# EAGLE schematic RBCX (EAGLE 9.6.2), part 1 of 3
Assembly variants: TOP_SMD_FULL, TOP_SMD_WITHOUT_MPU, TOP_SMD_WITHOUT_MOTOR_CURRENT, TOP_SMD_WITHOUT_SERVO_CURRENT, TOP_SMD_WITHOUT_CURRENT, TOP_SMD_MINIMAL

## Sheet 1 of 8: Power
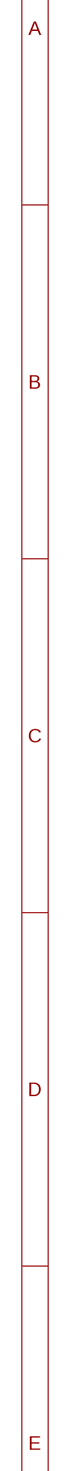
[diagram p0: schematic, sheet 1, part 1 of 2]
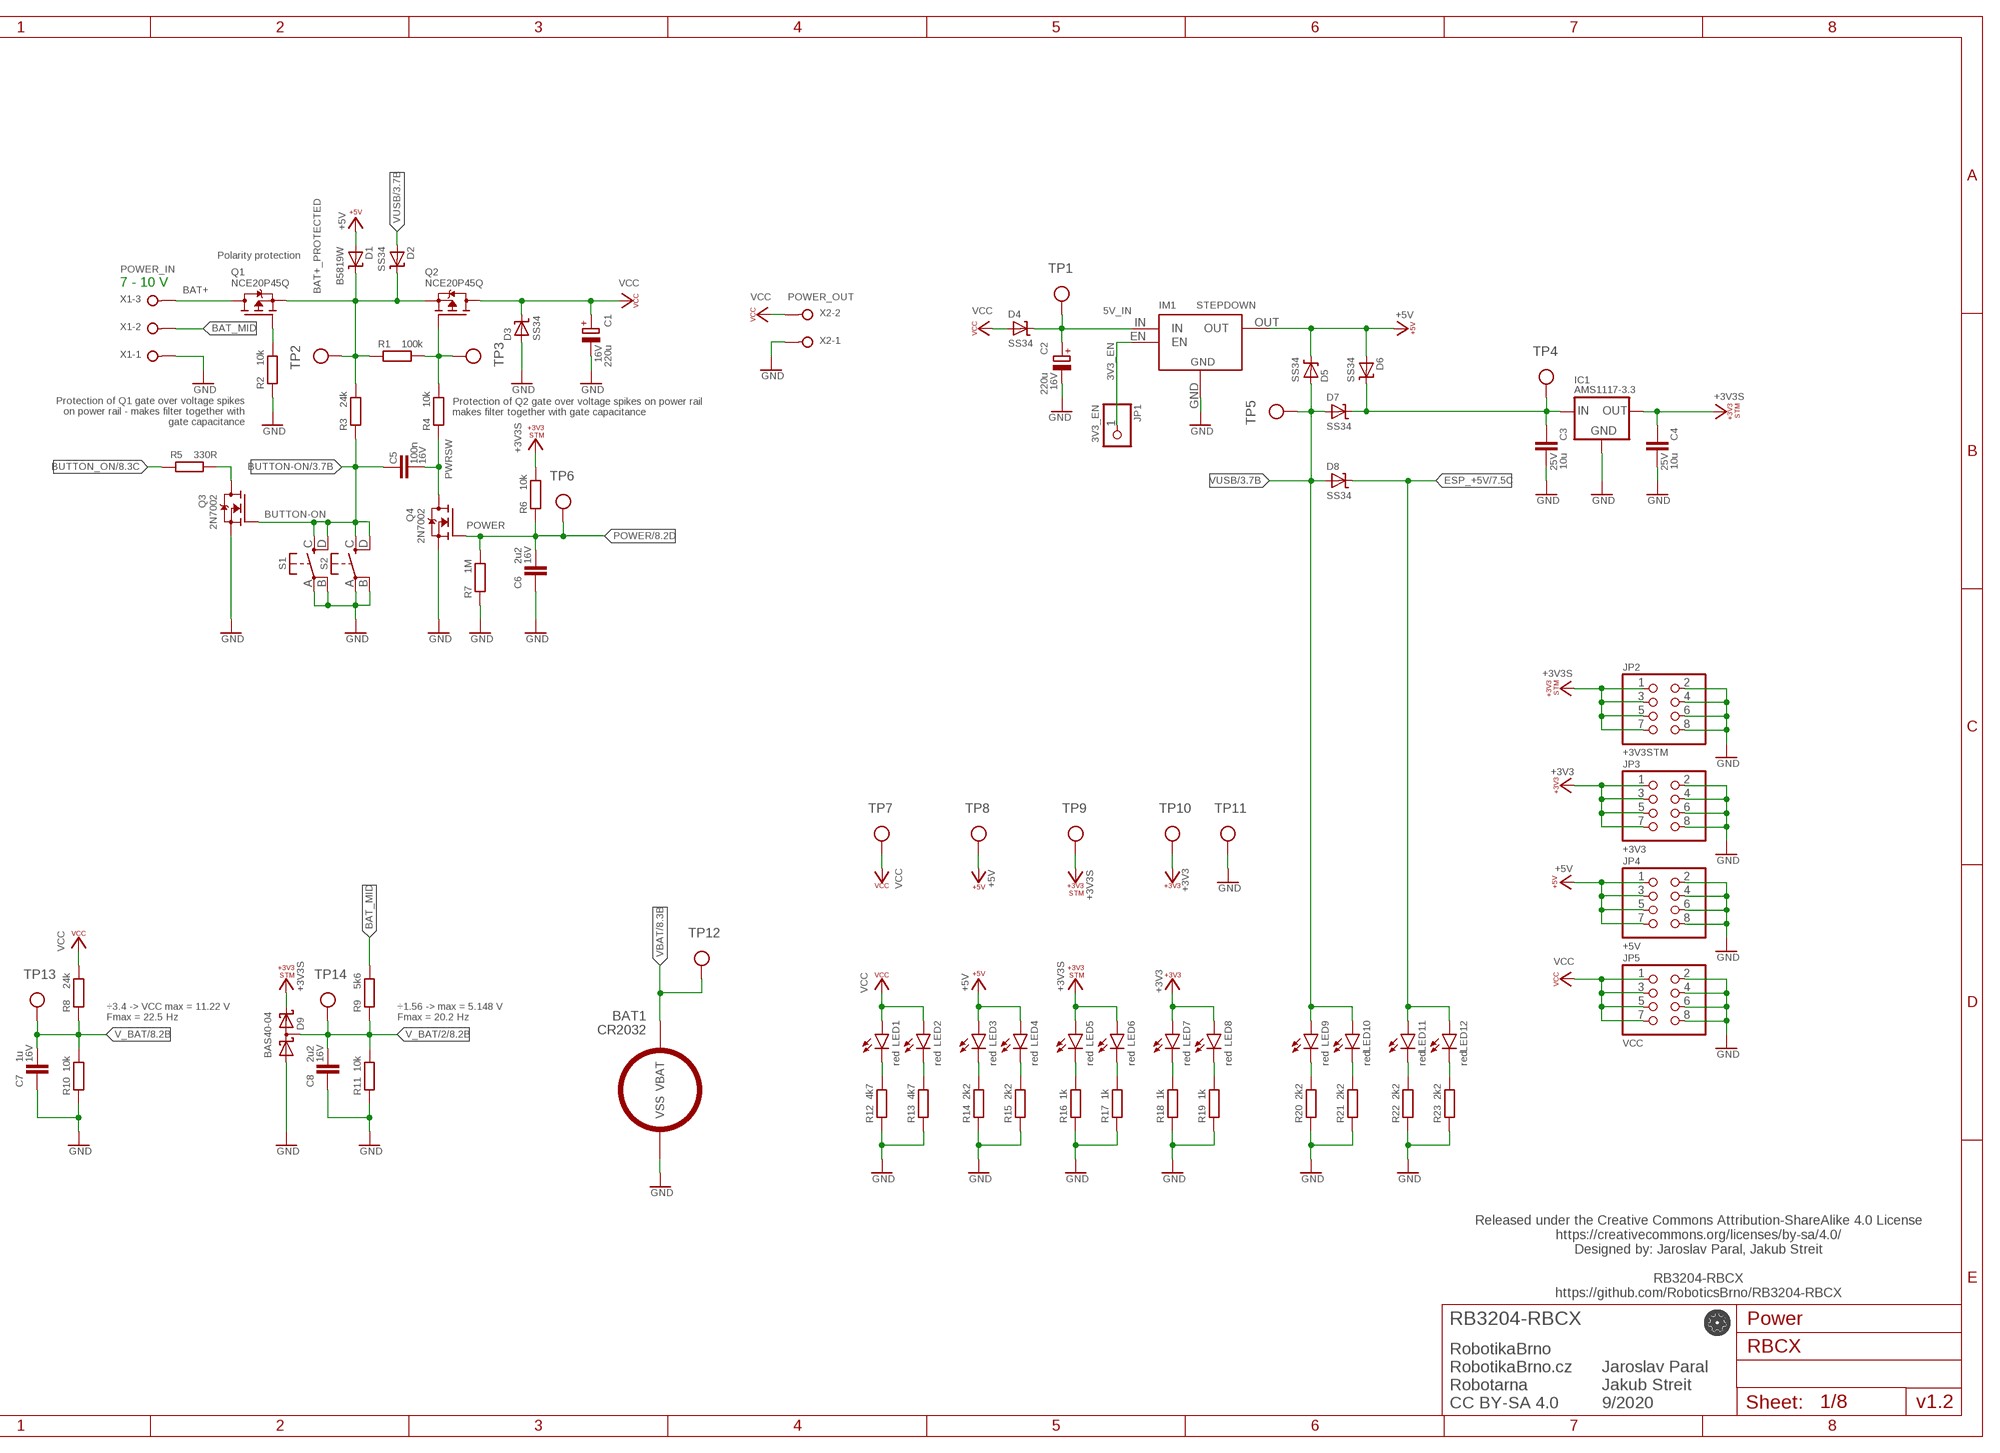
[diagram p1: schematic, sheet 1, part 2 of 2]

### Parts
BAT1  CR2032  CR2032CR2032-BS-6-1  [SMD-BAT-CR2032-BS-6-1]  (not fitted in variant TOP_SMD_FULL)  (not fitted in variant TOP_SMD_WITHOUT_MPU)  (not fitted in variant TOP_SMD_WITHOUT_MOTOR_CURRENT)  (not fitted in variant TOP_SMD_WITHOUT_SERVO_CURRENT)  (not fitted in variant TOP_SMD_WITHOUT_CURRENT)  (not fitted in variant TOP_SMD_MINIMAL)
C1  220u  CPOL-EUE5-10.5  [E5-10,5]  (not fitted in variant TOP_SMD_FULL)  (not fitted in variant TOP_SMD_WITHOUT_MPU)  (not fitted in variant TOP_SMD_WITHOUT_MOTOR_CURRENT)  (not fitted in variant TOP_SMD_WITHOUT_SERVO_CURRENT)  (not fitted in variant TOP_SMD_WITHOUT_CURRENT)  (not fitted in variant TOP_SMD_MINIMAL)
C2  220u  CPOL-EUE5-10.5  [E5-10,5]  (not fitted in variant TOP_SMD_FULL)  (not fitted in variant TOP_SMD_WITHOUT_MPU)  (not fitted in variant TOP_SMD_WITHOUT_MOTOR_CURRENT)  (not fitted in variant TOP_SMD_WITHOUT_SERVO_CURRENT)  (not fitted in variant TOP_SMD_WITHOUT_CURRENT)  (not fitted in variant TOP_SMD_MINIMAL)
C3  10u  C-EUC0805  [C0805]
C4  10u  C-EUC0805  [C0805]
C5  100n  C-EUC0402  [C0402]
C6  2u2  C-EUC0603  [C0603]
C7  1u  C-EUC0402  [C0402]
C8  2u2  C-EUC0603  [C0603]
D1  B5819W  SHOTTKY-SOD123  [SOD123]
D2  SS34  SHOTTKY-SMA  [SMA]
D3  SS34  SHOTTKY-SMA  [SMA]
D4  SS34  SHOTTKY-SMA  [SMA]
D5  SS34  SHOTTKY-SMA  [SMA]
D6  SS34  SHOTTKY-SMA  [SMA]
D7  SS34  SHOTTKY-SMA  [SMA]
D8  SS34  SHOTTKY-SMA  [SMA]
D9  BAS40-04  [SOT23]
IC1  AMS1117-3.3  AMS1117  [SOT223]
IM1  STEPDOWN  [STEPDOWN]  (not fitted in variant TOP_SMD_FULL)  (not fitted in variant TOP_SMD_WITHOUT_MPU)  (not fitted in variant TOP_SMD_WITHOUT_MOTOR_CURRENT)  (not fitted in variant TOP_SMD_WITHOUT_SERVO_CURRENT)  (not fitted in variant TOP_SMD_WITHOUT_CURRENT)  (not fitted in variant TOP_SMD_MINIMAL)
JP1  3V3_EN  PINHD-1X1  [1X01]  (not fitted in variant TOP_SMD_FULL)  (not fitted in variant TOP_SMD_WITHOUT_MPU)  (not fitted in variant TOP_SMD_WITHOUT_MOTOR_CURRENT)  (not fitted in variant TOP_SMD_WITHOUT_SERVO_CURRENT)  (not fitted in variant TOP_SMD_WITHOUT_CURRENT)  (not fitted in variant TOP_SMD_MINIMAL)
JP2  +3V3STM  PINHD-2X4  [2X04]  (not fitted in variant TOP_SMD_FULL)  (not fitted in variant TOP_SMD_WITHOUT_MPU)  (not fitted in variant TOP_SMD_WITHOUT_MOTOR_CURRENT)  (not fitted in variant TOP_SMD_WITHOUT_SERVO_CURRENT)  (not fitted in variant TOP_SMD_WITHOUT_CURRENT)  (not fitted in variant TOP_SMD_MINIMAL)
JP3  +3V3  PINHD-2X4  [2X04]  (not fitted in variant TOP_SMD_FULL)  (not fitted in variant TOP_SMD_WITHOUT_MPU)  (not fitted in variant TOP_SMD_WITHOUT_MOTOR_CURRENT)  (not fitted in variant TOP_SMD_WITHOUT_SERVO_CURRENT)  (not fitted in variant TOP_SMD_WITHOUT_CURRENT)  (not fitted in variant TOP_SMD_MINIMAL)
JP4  +5V  PINHD-2X4  [2X04]  (not fitted in variant TOP_SMD_FULL)  (not fitted in variant TOP_SMD_WITHOUT_MPU)  (not fitted in variant TOP_SMD_WITHOUT_MOTOR_CURRENT)  (not fitted in variant TOP_SMD_WITHOUT_SERVO_CURRENT)  (not fitted in variant TOP_SMD_WITHOUT_CURRENT)  (not fitted in variant TOP_SMD_MINIMAL)
JP5  VCC  PINHD-2X4  [2X04]  (not fitted in variant TOP_SMD_FULL)  (not fitted in variant TOP_SMD_WITHOUT_MPU)  (not fitted in variant TOP_SMD_WITHOUT_MOTOR_CURRENT)  (not fitted in variant TOP_SMD_WITHOUT_SERVO_CURRENT)  (not fitted in variant TOP_SMD_WITHOUT_CURRENT)  (not fitted in variant TOP_SMD_MINIMAL)
LED1  red  LEDCHIPLED_0603  [CHIPLED_0603]  (not fitted in variant TOP_SMD_MINIMAL)
LED2  red  LEDCHIPLED_0603  [CHIPLED_0603]  (not fitted in variant TOP_SMD_FULL)  (not fitted in variant TOP_SMD_WITHOUT_MPU)  (not fitted in variant TOP_SMD_WITHOUT_MOTOR_CURRENT)  (not fitted in variant TOP_SMD_WITHOUT_SERVO_CURRENT)  (not fitted in variant TOP_SMD_WITHOUT_CURRENT)  (not fitted in variant TOP_SMD_MINIMAL)
LED3  red  LEDCHIPLED_0603  [CHIPLED_0603]  (not fitted in variant TOP_SMD_MINIMAL)
LED4  red  LEDCHIPLED_0603  [CHIPLED_0603]  (not fitted in variant TOP_SMD_FULL)  (not fitted in variant TOP_SMD_WITHOUT_MPU)  (not fitted in variant TOP_SMD_WITHOUT_MOTOR_CURRENT)  (not fitted in variant TOP_SMD_WITHOUT_SERVO_CURRENT)  (not fitted in variant TOP_SMD_WITHOUT_CURRENT)  (not fitted in variant TOP_SMD_MINIMAL)
LED5  red  LEDCHIPLED_0603  [CHIPLED_0603]  (not fitted in variant TOP_SMD_MINIMAL)
LED6  red  LEDCHIPLED_0603  [CHIPLED_0603]  (not fitted in variant TOP_SMD_FULL)  (not fitted in variant TOP_SMD_WITHOUT_MPU)  (not fitted in variant TOP_SMD_WITHOUT_MOTOR_CURRENT)  (not fitted in variant TOP_SMD_WITHOUT_SERVO_CURRENT)  (not fitted in variant TOP_SMD_WITHOUT_CURRENT)  (not fitted in variant TOP_SMD_MINIMAL)
LED7  red  LEDCHIPLED_0603  [CHIPLED_0603]  (not fitted in variant TOP_SMD_MINIMAL)
LED8  red  LEDCHIPLED_0603  [CHIPLED_0603]  (not fitted in variant TOP_SMD_FULL)  (not fitted in variant TOP_SMD_WITHOUT_MPU)  (not fitted in variant TOP_SMD_WITHOUT_MOTOR_CURRENT)  (not fitted in variant TOP_SMD_WITHOUT_SERVO_CURRENT)  (not fitted in variant TOP_SMD_WITHOUT_CURRENT)  (not fitted in variant TOP_SMD_MINIMAL)
LED9  red  LEDCHIPLED_0603  [CHIPLED_0603]  (not fitted in variant TOP_SMD_MINIMAL)
LED10  red  LEDCHIPLED_0603  [CHIPLED_0603]  (not fitted in variant TOP_SMD_FULL)  (not fitted in variant TOP_SMD_WITHOUT_MPU)  (not fitted in variant TOP_SMD_WITHOUT_MOTOR_CURRENT)  (not fitted in variant TOP_SMD_WITHOUT_SERVO_CURRENT)  (not fitted in variant TOP_SMD_WITHOUT_CURRENT)  (not fitted in variant TOP_SMD_MINIMAL)
LED11  red  LEDCHIPLED_0603  [CHIPLED_0603]  (not fitted in variant TOP_SMD_MINIMAL)
LED12  red  LEDCHIPLED_0603  [CHIPLED_0603]  (not fitted in variant TOP_SMD_FULL)  (not fitted in variant TOP_SMD_WITHOUT_MPU)  (not fitted in variant TOP_SMD_WITHOUT_MOTOR_CURRENT)  (not fitted in variant TOP_SMD_WITHOUT_SERVO_CURRENT)  (not fitted in variant TOP_SMD_WITHOUT_CURRENT)  (not fitted in variant TOP_SMD_MINIMAL)
Q1  NCE20P45Q  P-MOSFET-MLP_HS  [MLP3.3X3.3_HS]
Q2  NCE20P45Q  P-MOSFET-MLP_HS  [MLP3.3X3.3_HS]
Q3  2N7002  N-MOSFET-SOT23-GSD  [SOT23]
Q4  2N7002  N-MOSFET-SOT23-GSD  [SOT23]
R1  100k  R-EU_R0402  [R0402]
R2  10k  R-EU_R0402  [R0402]
R3  24k  R-EU_R0402  [R0402]
R4  10k  R-EU_R0402  [R0402]
R5  330R  R-EU_R0402  [R0402]
R6  10k  R-EU_R0402  [R0402]
R7  1M  R-EU_R0402  [R0402]
R8  24k  R-EU_R0402  [R0402]
R9  5k6  R-EU_R0402  [R0402]
R10  10k  R-EU_R0402  [R0402]
R11  10k  R-EU_R0402  [R0402]
R12  4k7  R-EU_R0402  [R0402]  (not fitted in variant TOP_SMD_MINIMAL)
R13  4k7  R-EU_R0402  [R0402]  (not fitted in variant TOP_SMD_FULL)  (not fitted in variant TOP_SMD_WITHOUT_MPU)  (not fitted in variant TOP_SMD_WITHOUT_MOTOR_CURRENT)  (not fitted in variant TOP_SMD_WITHOUT_SERVO_CURRENT)  (not fitted in variant TOP_SMD_WITHOUT_CURRENT)  (not fitted in variant TOP_SMD_MINIMAL)
R14  2k2  R-EU_R0402  [R0402]  (not fitted in variant TOP_SMD_MINIMAL)
R15  2k2  R-EU_R0402  [R0402]  (not fitted in variant TOP_SMD_FULL)  (not fitted in variant TOP_SMD_WITHOUT_MPU)  (not fitted in variant TOP_SMD_WITHOUT_MOTOR_CURRENT)  (not fitted in variant TOP_SMD_WITHOUT_SERVO_CURRENT)  (not fitted in variant TOP_SMD_WITHOUT_CURRENT)  (not fitted in variant TOP_SMD_MINIMAL)
R16  1k  R-EU_R0402  [R0402]  (not fitted in variant TOP_SMD_MINIMAL)
R17  1k  R-EU_R0402  [R0402]  (not fitted in variant TOP_SMD_FULL)  (not fitted in variant TOP_SMD_WITHOUT_MPU)  (not fitted in variant TOP_SMD_WITHOUT_MOTOR_CURRENT)  (not fitted in variant TOP_SMD_WITHOUT_SERVO_CURRENT)  (not fitted in variant TOP_SMD_WITHOUT_CURRENT)  (not fitted in variant TOP_SMD_MINIMAL)
R18  1k  R-EU_R0402  [R0402]  (not fitted in variant TOP_SMD_MINIMAL)
R19  1k  R-EU_R0402  [R0402]  (not fitted in variant TOP_SMD_FULL)  (not fitted in variant TOP_SMD_WITHOUT_MPU)  (not fitted in variant TOP_SMD_WITHOUT_MOTOR_CURRENT)  (not fitted in variant TOP_SMD_WITHOUT_SERVO_CURRENT)  (not fitted in variant TOP_SMD_WITHOUT_CURRENT)  (not fitted in variant TOP_SMD_MINIMAL)
R20  2k2  R-EU_R0402  [R0402]  (not fitted in variant TOP_SMD_MINIMAL)
R21  2k2  R-EU_R0402  [R0402]  (not fitted in variant TOP_SMD_FULL)  (not fitted in variant TOP_SMD_WITHOUT_MPU)  (not fitted in variant TOP_SMD_WITHOUT_MOTOR_CURRENT)  (not fitted in variant TOP_SMD_WITHOUT_SERVO_CURRENT)  (not fitted in variant TOP_SMD_WITHOUT_CURRENT)  (not fitted in variant TOP_SMD_MINIMAL)
R22  2k2  R-EU_R0402  [R0402]  (not fitted in variant TOP_SMD_MINIMAL)
R23  2k2  R-EU_R0402  [R0402]  (not fitted in variant TOP_SMD_FULL)  (not fitted in variant TOP_SMD_WITHOUT_MPU)  (not fitted in variant TOP_SMD_WITHOUT_MOTOR_CURRENT)  (not fitted in variant TOP_SMD_WITHOUT_SERVO_CURRENT)  (not fitted in variant TOP_SMD_WITHOUT_CURRENT)  (not fitted in variant TOP_SMD_MINIMAL)
S1  TS-1187A-C-C-B  10-XX_SMD  [TS-1187A]  (not fitted in variant TOP_SMD_FULL)  (not fitted in variant TOP_SMD_WITHOUT_MPU)  (not fitted in variant TOP_SMD_WITHOUT_MOTOR_CURRENT)  (not fitted in variant TOP_SMD_WITHOUT_SERVO_CURRENT)  (not fitted in variant TOP_SMD_WITHOUT_CURRENT)  (not fitted in variant TOP_SMD_MINIMAL)
S2  TS-1187A-C-C-B  10-XX_SMD  [TS-1187A]
TP1  TP_06MM  [TP_06]  (not fitted in variant TOP_SMD_FULL)  (not fitted in variant TOP_SMD_WITHOUT_MPU)  (not fitted in variant TOP_SMD_WITHOUT_MOTOR_CURRENT)  (not fitted in variant TOP_SMD_WITHOUT_SERVO_CURRENT)  (not fitted in variant TOP_SMD_WITHOUT_CURRENT)  (not fitted in variant TOP_SMD_MINIMAL)
TP2  TP_06MM  [TP_06]  (not fitted in variant TOP_SMD_FULL)  (not fitted in variant TOP_SMD_WITHOUT_MPU)  (not fitted in variant TOP_SMD_WITHOUT_MOTOR_CURRENT)  (not fitted in variant TOP_SMD_WITHOUT_SERVO_CURRENT)  (not fitted in variant TOP_SMD_WITHOUT_CURRENT)  (not fitted in variant TOP_SMD_MINIMAL)
TP3  TP_06MM  [TP_06]  (not fitted in variant TOP_SMD_FULL)  (not fitted in variant TOP_SMD_WITHOUT_MPU)  (not fitted in variant TOP_SMD_WITHOUT_MOTOR_CURRENT)  (not fitted in variant TOP_SMD_WITHOUT_SERVO_CURRENT)  (not fitted in variant TOP_SMD_WITHOUT_CURRENT)  (not fitted in variant TOP_SMD_MINIMAL)
TP4  TP_06MM  [TP_06]  (not fitted in variant TOP_SMD_FULL)  (not fitted in variant TOP_SMD_WITHOUT_MPU)  (not fitted in variant TOP_SMD_WITHOUT_MOTOR_CURRENT)  (not fitted in variant TOP_SMD_WITHOUT_SERVO_CURRENT)  (not fitted in variant TOP_SMD_WITHOUT_CURRENT)  (not fitted in variant TOP_SMD_MINIMAL)
TP5  TP_06MM  [TP_06]  (not fitted in variant TOP_SMD_FULL)  (not fitted in variant TOP_SMD_WITHOUT_MPU)  (not fitted in variant TOP_SMD_WITHOUT_MOTOR_CURRENT)  (not fitted in variant TOP_SMD_WITHOUT_SERVO_CURRENT)  (not fitted in variant TOP_SMD_WITHOUT_CURRENT)  (not fitted in variant TOP_SMD_MINIMAL)
TP6  TP_06MM  [TP_06]  (not fitted in variant TOP_SMD_FULL)  (not fitted in variant TOP_SMD_WITHOUT_MPU)  (not fitted in variant TOP_SMD_WITHOUT_MOTOR_CURRENT)  (not fitted in variant TOP_SMD_WITHOUT_SERVO_CURRENT)  (not fitted in variant TOP_SMD_WITHOUT_CURRENT)  (not fitted in variant TOP_SMD_MINIMAL)
TP7  TP_06MM  [TP_06]  (not fitted in variant TOP_SMD_FULL)  (not fitted in variant TOP_SMD_WITHOUT_MPU)  (not fitted in variant TOP_SMD_WITHOUT_MOTOR_CURRENT)  (not fitted in variant TOP_SMD_WITHOUT_SERVO_CURRENT)  (not fitted in variant TOP_SMD_WITHOUT_CURRENT)  (not fitted in variant TOP_SMD_MINIMAL)
TP8  TP_06MM  [TP_06]  (not fitted in variant TOP_SMD_FULL)  (not fitted in variant TOP_SMD_WITHOUT_MPU)  (not fitted in variant TOP_SMD_WITHOUT_MOTOR_CURRENT)  (not fitted in variant TOP_SMD_WITHOUT_SERVO_CURRENT)  (not fitted in variant TOP_SMD_WITHOUT_CURRENT)  (not fitted in variant TOP_SMD_MINIMAL)
TP9  TP_06MM  [TP_06]  (not fitted in variant TOP_SMD_FULL)  (not fitted in variant TOP_SMD_WITHOUT_MPU)  (not fitted in variant TOP_SMD_WITHOUT_MOTOR_CURRENT)  (not fitted in variant TOP_SMD_WITHOUT_SERVO_CURRENT)  (not fitted in variant TOP_SMD_WITHOUT_CURRENT)  (not fitted in variant TOP_SMD_MINIMAL)
TP10  TP_06MM  [TP_06]  (not fitted in variant TOP_SMD_FULL)  (not fitted in variant TOP_SMD_WITHOUT_MPU)  (not fitted in variant TOP_SMD_WITHOUT_MOTOR_CURRENT)  (not fitted in variant TOP_SMD_WITHOUT_SERVO_CURRENT)  (not fitted in variant TOP_SMD_WITHOUT_CURRENT)  (not fitted in variant TOP_SMD_MINIMAL)
TP11  TP_08MM  [TP_08]  (not fitted in variant TOP_SMD_FULL)  (not fitted in variant TOP_SMD_WITHOUT_MPU)  (not fitted in variant TOP_SMD_WITHOUT_MOTOR_CURRENT)  (not fitted in variant TOP_SMD_WITHOUT_SERVO_CURRENT)  (not fitted in variant TOP_SMD_WITHOUT_CURRENT)  (not fitted in variant TOP_SMD_MINIMAL)
TP12  TP_06MM  [TP_06]  (not fitted in variant TOP_SMD_FULL)  (not fitted in variant TOP_SMD_WITHOUT_MPU)  (not fitted in variant TOP_SMD_WITHOUT_MOTOR_CURRENT)  (not fitted in variant TOP_SMD_WITHOUT_SERVO_CURRENT)  (not fitted in variant TOP_SMD_WITHOUT_CURRENT)  (not fitted in variant TOP_SMD_MINIMAL)
TP13  TP_06MM  [TP_06]  (not fitted in variant TOP_SMD_FULL)  (not fitted in variant TOP_SMD_WITHOUT_MPU)  (not fitted in variant TOP_SMD_WITHOUT_MOTOR_CURRENT)  (not fitted in variant TOP_SMD_WITHOUT_SERVO_CURRENT)  (not fitted in variant TOP_SMD_WITHOUT_CURRENT)  (not fitted in variant TOP_SMD_MINIMAL)
TP14  TP_06MM  [TP_06]  (not fitted in variant TOP_SMD_FULL)  (not fitted in variant TOP_SMD_WITHOUT_MPU)  (not fitted in variant TOP_SMD_WITHOUT_MOTOR_CURRENT)  (not fitted in variant TOP_SMD_WITHOUT_SERVO_CURRENT)  (not fitted in variant TOP_SMD_WITHOUT_CURRENT)  (not fitted in variant TOP_SMD_MINIMAL)
X1  POWER_IN  W237-03P  [W237-133]  (not fitted in variant TOP_SMD_FULL)  (not fitted in variant TOP_SMD_WITHOUT_MPU)  (not fitted in variant TOP_SMD_WITHOUT_MOTOR_CURRENT)  (not fitted in variant TOP_SMD_WITHOUT_SERVO_CURRENT)  (not fitted in variant TOP_SMD_WITHOUT_CURRENT)  (not fitted in variant TOP_SMD_MINIMAL)
X2  POWER_OUT  W237-02P  [W237-132]  (not fitted in variant TOP_SMD_FULL)  (not fitted in variant TOP_SMD_WITHOUT_MPU)  (not fitted in variant TOP_SMD_WITHOUT_MOTOR_CURRENT)  (not fitted in variant TOP_SMD_WITHOUT_SERVO_CURRENT)  (not fitted in variant TOP_SMD_WITHOUT_CURRENT)  (not fitted in variant TOP_SMD_MINIMAL)

### Nets
3V3_EN: IM1.EN JP1.1
3V3_IN: C3.2 D6.C D7.C IC1.3(IN) TP4.P$1(TP)
5V_IN: C2.+ D4.C IM1.IN TP1.P$1(TP)
+3V3: JP3.1 JP3.3 JP3.5 JP3.7 LED7.A LED8.A TP10.P$1(TP) ; also sheet 2,3,7
+3V3S: C4.2 D9.2(C2) IC1.2(OUT) IC1.4(OUT) JP2.1 JP2.3 JP2.5 JP2.7 LED5.A LED6.A R6.2 TP9.P$1(TP) ; also sheet 2,3,4,5,6,8
+5V: D1.A D5.C D6.A IM1.OUT JP4.1 JP4.3 JP4.5 JP4.7 LED3.A LED4.A TP8.P$1(TP) ; also sheet 2,3,4,5,6,7
BAT+: Q1.5(D) Q1.6(D) Q1.7(D) Q1.8(D) Q1.9(D) X1.3
BAT+_PROTECTED: D1.C D2.C Q1.1(S) Q1.2(S) Q1.3(S) Q2.1(S) Q2.2(S) Q2.3(S) R1.1 R3.2 TP2.P$1(TP)
BAT_MID: R9.2 X1.2
BUTTON-ON: C5.2 Q3.1(G) R3.1 S1.C(S) S1.D(S1) S2.C(S) S2.D(S1) ; also sheet 3,4
BUTTON-ON-LV: Q3.3(D) R5.2
BUTTON_ON: R5.1 ; also sheet 8
ESP_+5V: D8.C LED11.A LED12.A ; also sheet 7
GND: BAT1.VSS C1.- C2.- C3.1 C4.1 C6.2 C7.2 C8.2 D3.A D9.1(A1) IC1.1(GND) IM1.GND JP2.2 JP2.4 JP2.6 JP2.8 JP3.2 JP3.4 JP3.6 JP3.8 JP4.2 JP4.4 JP4.6 JP4.8 JP5.2 JP5.4 JP5.6 JP5.8 Q3.2(S) Q4.2(S) R2.1 R7.1 R10.1 R11.1 R12.1 R13.1 R14.1 R15.1 R16.1 R17.1 R18.1 R19.1 R20.1 R21.1 R22.1 R23.1 S1.A(P) S1.B(P1) S2.A(P) S2.B(P1) TP11.P$1(TP) X1.1 X2.1 ; also sheet 2,3,4,5,6,7,8
POWER: C6.1 Q4.1(G) R6.1 R7.2 TP6.P$1(TP) ; also sheet 8
PROT_GATE: Q1.4(G) R2.2
PWRLED_+3V3: LED7.C R18.2
PWRLED_+3V3B: LED8.C R19.2
PWRLED_+3V3S: LED5.C R16.2
PWRLED_+3V3S_B: LED6.C R17.2
PWRLED_+5V: LED3.C R14.2
PWRLED_+5V_B: LED4.C R15.2
PWRLED_+5VESP: LED11.C R22.2
PWRLED_+5VESP_B: LED12.C R23.2
PWRLED_VCC: LED1.C R12.2
PWRLED_VCC_B: LED2.C R13.2
PWRLED_VUSB: LED9.C R20.2
PWRLED_VUSB_B: LED10.C R21.2
PWRSW: C5.1 Q4.3(D) R4.1
PWRSW_GATE: Q2.4(G) R1.2 R4.2 TP3.P$1(TP)
V_BAT: C7.1 R8.1 R10.2 TP13.P$1(TP) ; also sheet 8
V_BAT/2: C8.1 D9.3(C1A2) R9.1 R11.2 TP14.P$1(TP) ; also sheet 8
VBAT: BAT1.VBAT TP12.P$1(TP) ; also sheet 8
VCC: C1.+ D3.C D4.A JP5.1 JP5.3 JP5.5 JP5.7 LED1.A LED2.A Q2.5(D) Q2.6(D) Q2.7(D) Q2.8(D) Q2.9(D) R8.2 TP7.P$1(TP) X2.2 ; also sheet 2,3,4,5,6
VUSB: D2.A D5.A D7.A D8.A LED9.A LED10.A TP5.P$1(TP) ; also sheet 3

### Notes on the sheet
- Polarity protection
- 7 - 10 V
- Protection of Q2 gate over voltage spikes on power rail
  makes filter together with gate capacitance
- Protection of Q1 gate over voltage spikes
  on power rail - makes filter together with
  gate capacitance
- ÷3.4 -> VCC max = 11.22 V
  Fmax = 22.5 Hz
- ÷1.56 -> max = 5.148 V
  Fmax = 20.2 Hz
- Released under the Creative Commons Attribution-ShareAlike 4.0 License
  https://creativecommons.org/licenses/by-sa/4.0/
  Designed by: Jaroslav Paral, Jakub Streit
  
  RB3204-RBCX
  https://github.com/RoboticsBrno/RB3204-RBCX
- RB3204-RBCX
- RobotikaBrno
  RobotikaBrno.cz
  Robotarna
  CC BY-SA 4.0
- Jaroslav Paral
  Jakub Streit
  9/2020
- v1.2

## Sheet 2 of 8: Connectors
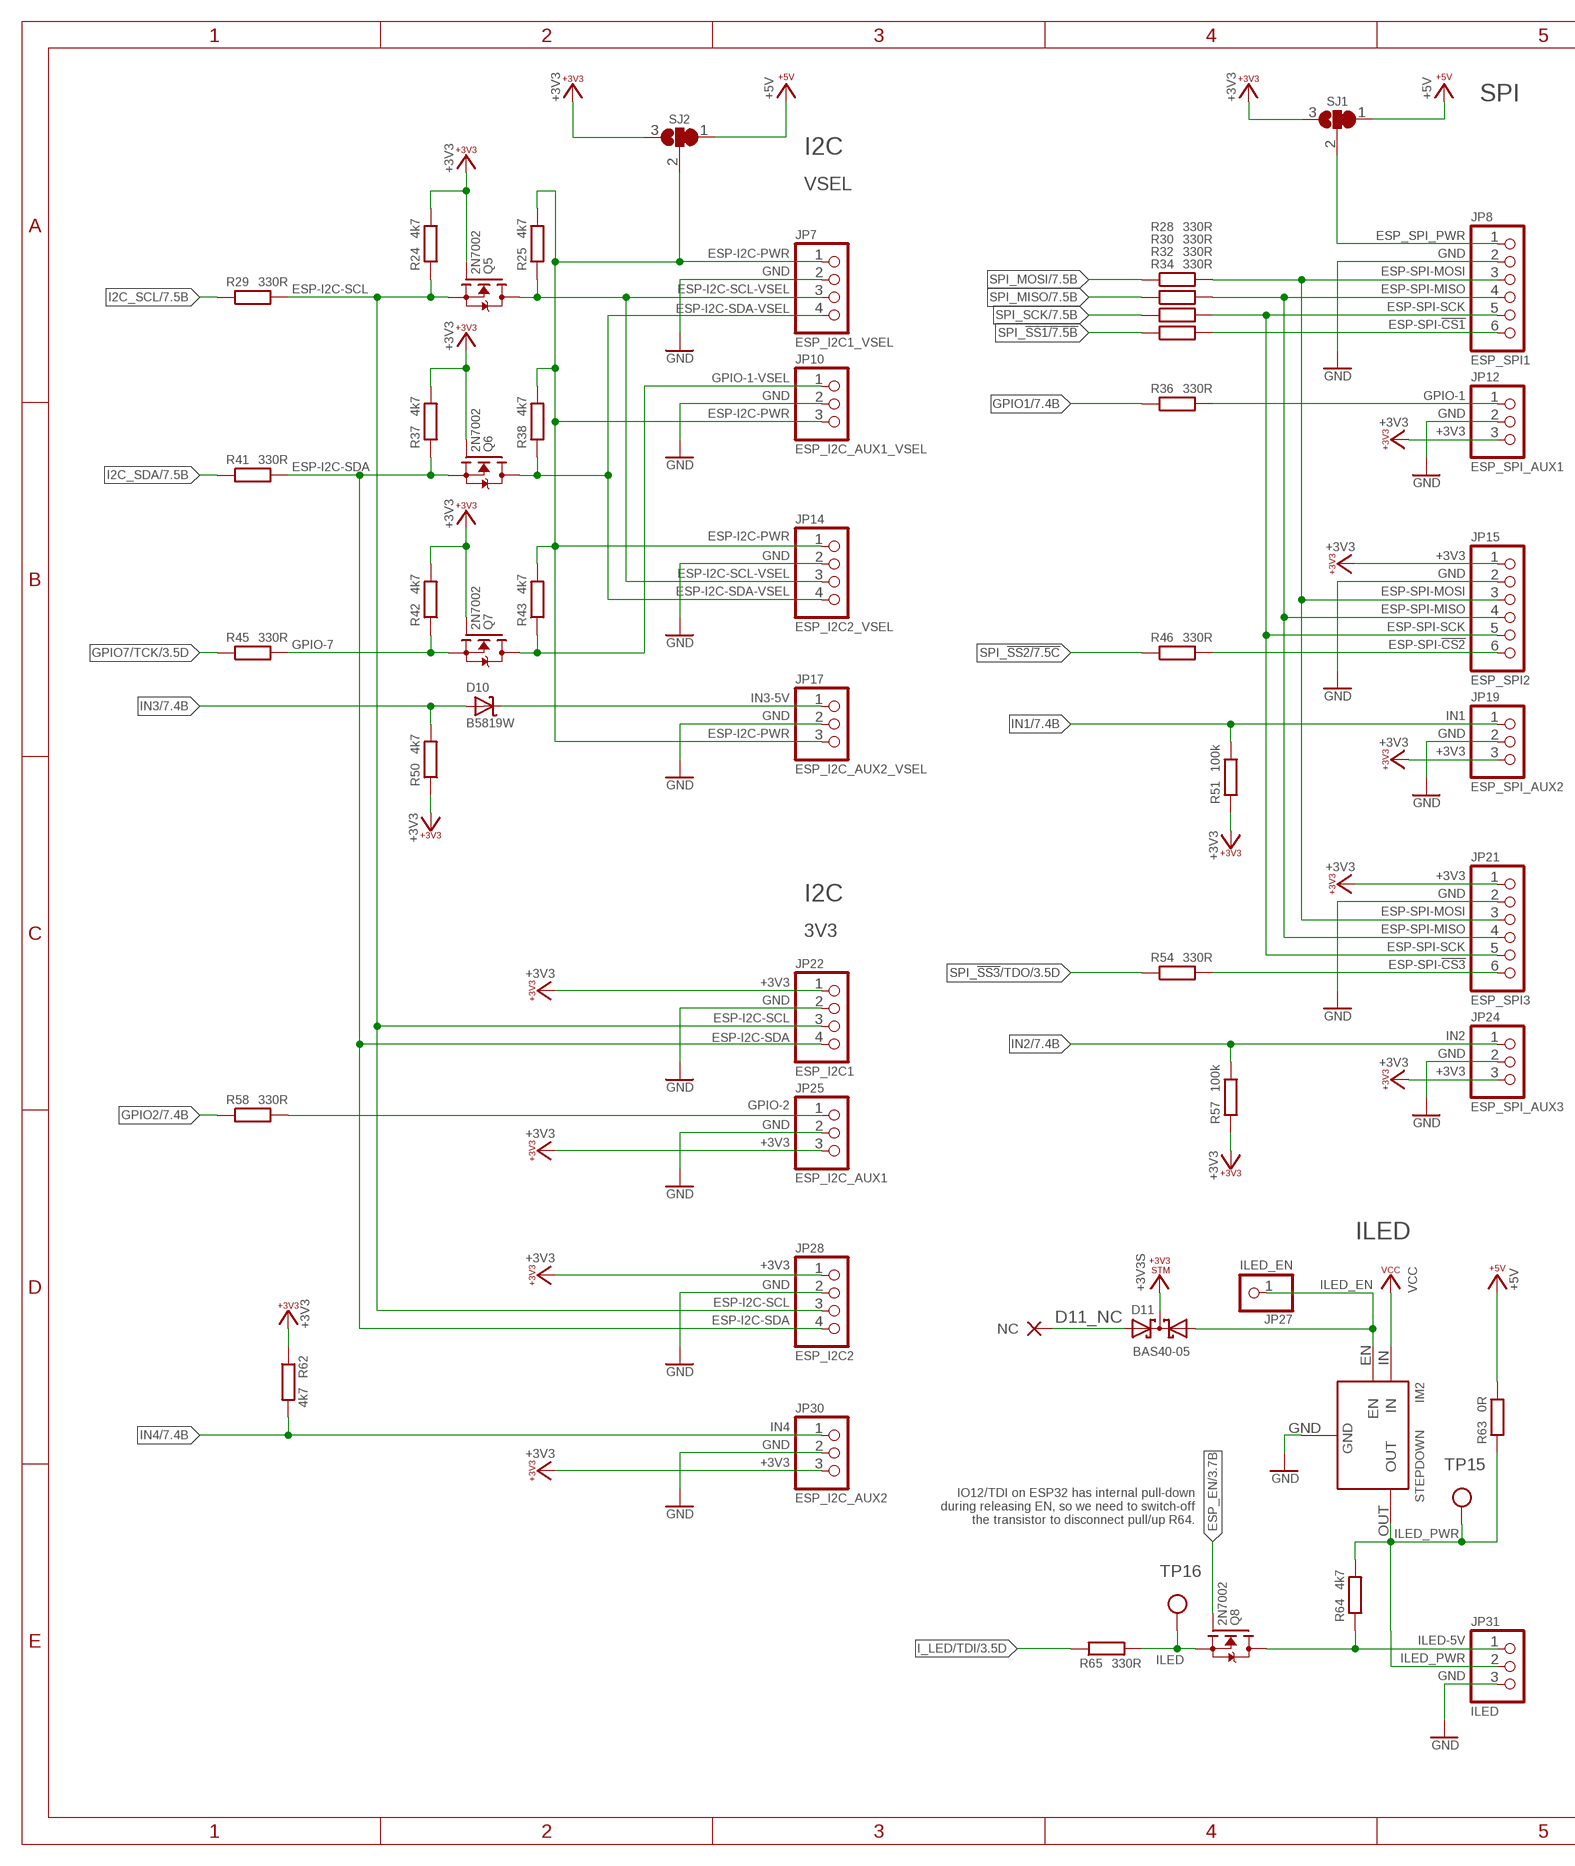
[diagram p2: schematic, sheet 2, part 1 of 2]
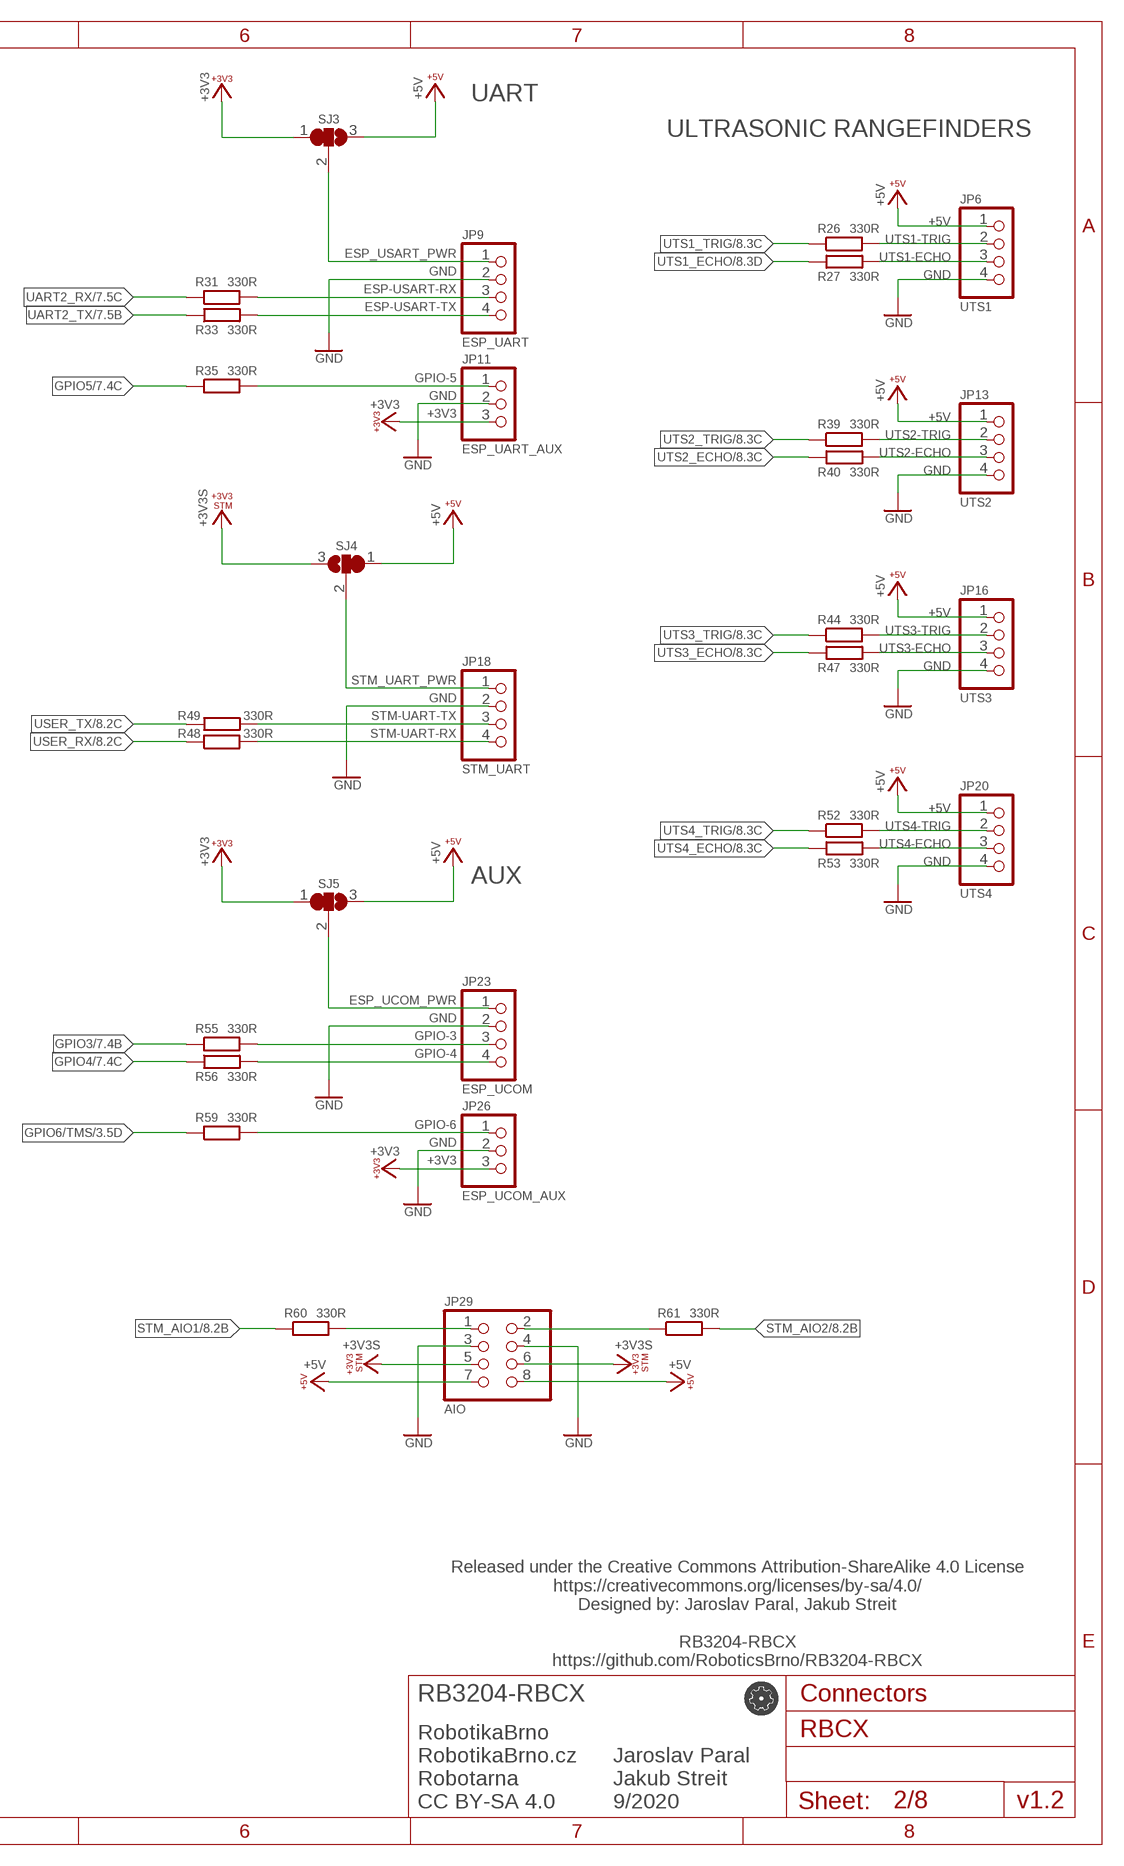
[diagram p3: schematic, sheet 2, part 2 of 2]

### Parts
D10  B5819W  SHOTTKY-SOD123  [SOD123]
D11  BAS40-05  [SOT23]  (not fitted in variant TOP_SMD_MINIMAL)
IM2  STEPDOWN  [STEPDOWN]  (not fitted in variant TOP_SMD_FULL)  (not fitted in variant TOP_SMD_WITHOUT_MPU)  (not fitted in variant TOP_SMD_WITHOUT_MOTOR_CURRENT)  (not fitted in variant TOP_SMD_WITHOUT_SERVO_CURRENT)  (not fitted in variant TOP_SMD_WITHOUT_CURRENT)  (not fitted in variant TOP_SMD_MINIMAL)
JP6  UTS1  PINHD-1X4  [1X04]  (not fitted in variant TOP_SMD_FULL)  (not fitted in variant TOP_SMD_WITHOUT_MPU)  (not fitted in variant TOP_SMD_WITHOUT_MOTOR_CURRENT)  (not fitted in variant TOP_SMD_WITHOUT_SERVO_CURRENT)  (not fitted in variant TOP_SMD_WITHOUT_CURRENT)  (not fitted in variant TOP_SMD_MINIMAL)
JP7  ESP_I2C1_VSEL  PINHD-1X4  [1X04]  (not fitted in variant TOP_SMD_FULL)  (not fitted in variant TOP_SMD_WITHOUT_MPU)  (not fitted in variant TOP_SMD_WITHOUT_MOTOR_CURRENT)  (not fitted in variant TOP_SMD_WITHOUT_SERVO_CURRENT)  (not fitted in variant TOP_SMD_WITHOUT_CURRENT)  (not fitted in variant TOP_SMD_MINIMAL)
JP8  ESP_SPI1  PINHD-1X6  [1X06]  (not fitted in variant TOP_SMD_FULL)  (not fitted in variant TOP_SMD_WITHOUT_MPU)  (not fitted in variant TOP_SMD_WITHOUT_MOTOR_CURRENT)  (not fitted in variant TOP_SMD_WITHOUT_SERVO_CURRENT)  (not fitted in variant TOP_SMD_WITHOUT_CURRENT)  (not fitted in variant TOP_SMD_MINIMAL)
JP9  ESP_UART  PINHD-1X4  [1X04]  (not fitted in variant TOP_SMD_FULL)  (not fitted in variant TOP_SMD_WITHOUT_MPU)  (not fitted in variant TOP_SMD_WITHOUT_MOTOR_CURRENT)  (not fitted in variant TOP_SMD_WITHOUT_SERVO_CURRENT)  (not fitted in variant TOP_SMD_WITHOUT_CURRENT)  (not fitted in variant TOP_SMD_MINIMAL)
JP10  ESP_I2C_AUX1_VSEL  PINHD-1X3  [1X03]  (not fitted in variant TOP_SMD_FULL)  (not fitted in variant TOP_SMD_WITHOUT_MPU)  (not fitted in variant TOP_SMD_WITHOUT_MOTOR_CURRENT)  (not fitted in variant TOP_SMD_WITHOUT_SERVO_CURRENT)  (not fitted in variant TOP_SMD_WITHOUT_CURRENT)  (not fitted in variant TOP_SMD_MINIMAL)
JP11  ESP_UART_AUX  PINHD-1X3  [1X03]  (not fitted in variant TOP_SMD_FULL)  (not fitted in variant TOP_SMD_WITHOUT_MPU)  (not fitted in variant TOP_SMD_WITHOUT_MOTOR_CURRENT)  (not fitted in variant TOP_SMD_WITHOUT_SERVO_CURRENT)  (not fitted in variant TOP_SMD_WITHOUT_CURRENT)  (not fitted in variant TOP_SMD_MINIMAL)
JP12  ESP_SPI_AUX1  PINHD-1X3  [1X03]  (not fitted in variant TOP_SMD_FULL)  (not fitted in variant TOP_SMD_WITHOUT_MPU)  (not fitted in variant TOP_SMD_WITHOUT_MOTOR_CURRENT)  (not fitted in variant TOP_SMD_WITHOUT_SERVO_CURRENT)  (not fitted in variant TOP_SMD_WITHOUT_CURRENT)  (not fitted in variant TOP_SMD_MINIMAL)
JP13  UTS2  PINHD-1X4  [1X04]  (not fitted in variant TOP_SMD_FULL)  (not fitted in variant TOP_SMD_WITHOUT_MPU)  (not fitted in variant TOP_SMD_WITHOUT_MOTOR_CURRENT)  (not fitted in variant TOP_SMD_WITHOUT_SERVO_CURRENT)  (not fitted in variant TOP_SMD_WITHOUT_CURRENT)  (not fitted in variant TOP_SMD_MINIMAL)
JP14  ESP_I2C2_VSEL  PINHD-1X4  [1X04]  (not fitted in variant TOP_SMD_FULL)  (not fitted in variant TOP_SMD_WITHOUT_MPU)  (not fitted in variant TOP_SMD_WITHOUT_MOTOR_CURRENT)  (not fitted in variant TOP_SMD_WITHOUT_SERVO_CURRENT)  (not fitted in variant TOP_SMD_WITHOUT_CURRENT)  (not fitted in variant TOP_SMD_MINIMAL)
JP15  ESP_SPI2  PINHD-1X6  [1X06]  (not fitted in variant TOP_SMD_FULL)  (not fitted in variant TOP_SMD_WITHOUT_MPU)  (not fitted in variant TOP_SMD_WITHOUT_MOTOR_CURRENT)  (not fitted in variant TOP_SMD_WITHOUT_SERVO_CURRENT)  (not fitted in variant TOP_SMD_WITHOUT_CURRENT)  (not fitted in variant TOP_SMD_MINIMAL)
JP16  UTS3  PINHD-1X4  [1X04]  (not fitted in variant TOP_SMD_FULL)  (not fitted in variant TOP_SMD_WITHOUT_MPU)  (not fitted in variant TOP_SMD_WITHOUT_MOTOR_CURRENT)  (not fitted in variant TOP_SMD_WITHOUT_SERVO_CURRENT)  (not fitted in variant TOP_SMD_WITHOUT_CURRENT)  (not fitted in variant TOP_SMD_MINIMAL)
JP17  ESP_I2C_AUX2_VSEL  PINHD-1X3  [1X03]  (not fitted in variant TOP_SMD_FULL)  (not fitted in variant TOP_SMD_WITHOUT_MPU)  (not fitted in variant TOP_SMD_WITHOUT_MOTOR_CURRENT)  (not fitted in variant TOP_SMD_WITHOUT_SERVO_CURRENT)  (not fitted in variant TOP_SMD_WITHOUT_CURRENT)  (not fitted in variant TOP_SMD_MINIMAL)
JP18  STM_UART  PINHD-1X4  [1X04]  (not fitted in variant TOP_SMD_FULL)  (not fitted in variant TOP_SMD_WITHOUT_MPU)  (not fitted in variant TOP_SMD_WITHOUT_MOTOR_CURRENT)  (not fitted in variant TOP_SMD_WITHOUT_SERVO_CURRENT)  (not fitted in variant TOP_SMD_WITHOUT_CURRENT)  (not fitted in variant TOP_SMD_MINIMAL)
JP19  ESP_SPI_AUX2  PINHD-1X3  [1X03]  (not fitted in variant TOP_SMD_FULL)  (not fitted in variant TOP_SMD_WITHOUT_MPU)  (not fitted in variant TOP_SMD_WITHOUT_MOTOR_CURRENT)  (not fitted in variant TOP_SMD_WITHOUT_SERVO_CURRENT)  (not fitted in variant TOP_SMD_WITHOUT_CURRENT)  (not fitted in variant TOP_SMD_MINIMAL)
JP20  UTS4  PINHD-1X4  [1X04]  (not fitted in variant TOP_SMD_FULL)  (not fitted in variant TOP_SMD_WITHOUT_MPU)  (not fitted in variant TOP_SMD_WITHOUT_MOTOR_CURRENT)  (not fitted in variant TOP_SMD_WITHOUT_SERVO_CURRENT)  (not fitted in variant TOP_SMD_WITHOUT_CURRENT)  (not fitted in variant TOP_SMD_MINIMAL)
JP21  ESP_SPI3  PINHD-1X6  [1X06]  (not fitted in variant TOP_SMD_FULL)  (not fitted in variant TOP_SMD_WITHOUT_MPU)  (not fitted in variant TOP_SMD_WITHOUT_MOTOR_CURRENT)  (not fitted in variant TOP_SMD_WITHOUT_SERVO_CURRENT)  (not fitted in variant TOP_SMD_WITHOUT_CURRENT)  (not fitted in variant TOP_SMD_MINIMAL)
JP22  ESP_I2C1  PINHD-1X4  [1X04]  (not fitted in variant TOP_SMD_FULL)  (not fitted in variant TOP_SMD_WITHOUT_MPU)  (not fitted in variant TOP_SMD_WITHOUT_MOTOR_CURRENT)  (not fitted in variant TOP_SMD_WITHOUT_SERVO_CURRENT)  (not fitted in variant TOP_SMD_WITHOUT_CURRENT)  (not fitted in variant TOP_SMD_MINIMAL)
JP23  ESP_UCOM  PINHD-1X4  [1X04]  (not fitted in variant TOP_SMD_FULL)  (not fitted in variant TOP_SMD_WITHOUT_MPU)  (not fitted in variant TOP_SMD_WITHOUT_MOTOR_CURRENT)  (not fitted in variant TOP_SMD_WITHOUT_SERVO_CURRENT)  (not fitted in variant TOP_SMD_WITHOUT_CURRENT)  (not fitted in variant TOP_SMD_MINIMAL)
JP24  ESP_SPI_AUX3  PINHD-1X3  [1X03]  (not fitted in variant TOP_SMD_FULL)  (not fitted in variant TOP_SMD_WITHOUT_MPU)  (not fitted in variant TOP_SMD_WITHOUT_MOTOR_CURRENT)  (not fitted in variant TOP_SMD_WITHOUT_SERVO_CURRENT)  (not fitted in variant TOP_SMD_WITHOUT_CURRENT)  (not fitted in variant TOP_SMD_MINIMAL)
JP25  ESP_I2C_AUX1  PINHD-1X3  [1X03]  (not fitted in variant TOP_SMD_FULL)  (not fitted in variant TOP_SMD_WITHOUT_MPU)  (not fitted in variant TOP_SMD_WITHOUT_MOTOR_CURRENT)  (not fitted in variant TOP_SMD_WITHOUT_SERVO_CURRENT)  (not fitted in variant TOP_SMD_WITHOUT_CURRENT)  (not fitted in variant TOP_SMD_MINIMAL)
JP26  ESP_UCOM_AUX  PINHD-1X3  [1X03]  (not fitted in variant TOP_SMD_FULL)  (not fitted in variant TOP_SMD_WITHOUT_MPU)  (not fitted in variant TOP_SMD_WITHOUT_MOTOR_CURRENT)  (not fitted in variant TOP_SMD_WITHOUT_SERVO_CURRENT)  (not fitted in variant TOP_SMD_WITHOUT_CURRENT)  (not fitted in variant TOP_SMD_MINIMAL)
JP27  ILED_EN  PINHD-1X1  [1X01]  (not fitted in variant TOP_SMD_FULL)  (not fitted in variant TOP_SMD_WITHOUT_MPU)  (not fitted in variant TOP_SMD_WITHOUT_MOTOR_CURRENT)  (not fitted in variant TOP_SMD_WITHOUT_SERVO_CURRENT)  (not fitted in variant TOP_SMD_WITHOUT_CURRENT)  (not fitted in variant TOP_SMD_MINIMAL)
JP28  ESP_I2C2  PINHD-1X4  [1X04]  (not fitted in variant TOP_SMD_FULL)  (not fitted in variant TOP_SMD_WITHOUT_MPU)  (not fitted in variant TOP_SMD_WITHOUT_MOTOR_CURRENT)  (not fitted in variant TOP_SMD_WITHOUT_SERVO_CURRENT)  (not fitted in variant TOP_SMD_WITHOUT_CURRENT)  (not fitted in variant TOP_SMD_MINIMAL)
JP29  AIO  PINHD-2X4  [2X04]  (not fitted in variant TOP_SMD_FULL)  (not fitted in variant TOP_SMD_WITHOUT_MPU)  (not fitted in variant TOP_SMD_WITHOUT_MOTOR_CURRENT)  (not fitted in variant TOP_SMD_WITHOUT_SERVO_CURRENT)  (not fitted in variant TOP_SMD_WITHOUT_CURRENT)  (not fitted in variant TOP_SMD_MINIMAL)
JP30  ESP_I2C_AUX2  PINHD-1X3  [1X03]  (not fitted in variant TOP_SMD_FULL)  (not fitted in variant TOP_SMD_WITHOUT_MPU)  (not fitted in variant TOP_SMD_WITHOUT_MOTOR_CURRENT)  (not fitted in variant TOP_SMD_WITHOUT_SERVO_CURRENT)  (not fitted in variant TOP_SMD_WITHOUT_CURRENT)  (not fitted in variant TOP_SMD_MINIMAL)
JP31  ILED  PINHD-1X3  [1X03]  (not fitted in variant TOP_SMD_FULL)  (not fitted in variant TOP_SMD_WITHOUT_MPU)  (not fitted in variant TOP_SMD_WITHOUT_MOTOR_CURRENT)  (not fitted in variant TOP_SMD_WITHOUT_SERVO_CURRENT)  (not fitted in variant TOP_SMD_WITHOUT_CURRENT)  (not fitted in variant TOP_SMD_MINIMAL)
NC7  NC  (no package)
Q5  2N7002  N-MOSFET-SOT23-GSD  [SOT23]
Q6  2N7002  N-MOSFET-SOT23-GSD  [SOT23]
Q7  2N7002  N-MOSFET-SOT23-GSD  [SOT23]
Q8  2N7002  N-MOSFET-SOT23-GSD  [SOT23]
R24  4k7  R-EU_R0402  [R0402]
R25  4k7  R-EU_R0402  [R0402]
R26  330R  R-EU_R0402  [R0402]
R27  330R  R-EU_R0402  [R0402]
R28  330R  R-EU_R0402  [R0402]
R29  330R  R-EU_R0402  [R0402]
R30  330R  R-EU_R0402  [R0402]
R31  330R  R-EU_R0402  [R0402]
R32  330R  R-EU_R0402  [R0402]
R33  330R  R-EU_R0402  [R0402]
R34  330R  R-EU_R0402  [R0402]
R35  330R  R-EU_R0402  [R0402]
R36  330R  R-EU_R0402  [R0402]
R37  4k7  R-EU_R0402  [R0402]
R38  4k7  R-EU_R0402  [R0402]
R39  330R  R-EU_R0402  [R0402]
R40  330R  R-EU_R0402  [R0402]
R41  330R  R-EU_R0402  [R0402]
R42  4k7  R-EU_R0402  [R0402]
R43  4k7  R-EU_R0402  [R0402]
R44  330R  R-EU_R0402  [R0402]
R45  330R  R-EU_R0402  [R0402]
R46  330R  R-EU_R0402  [R0402]
R47  330R  R-EU_R0402  [R0402]
R48  330R  R-EU_R0402  [R0402]
R49  330R  R-EU_R0402  [R0402]
R50  4k7  R-EU_R0402  [R0402]
R51  100k  R-EU_R0402  [R0402]
R52  330R  R-EU_R0402  [R0402]
R53  330R  R-EU_R0402  [R0402]
R54  330R  R-EU_R0402  [R0402]
R55  330R  R-EU_R0402  [R0402]
R56  330R  R-EU_R0402  [R0402]
R57  100k  R-EU_R0402  [R0402]
R58  330R  R-EU_R0402  [R0402]
R59  330R  R-EU_R0402  [R0402]
R60  330R  R-EU_R0402  [R0402]
R61  330R  R-EU_R0402  [R0402]
R62  4k7  R-EU_R0402  [R0402]
R63  0R  R-EU_R1206  [R1206]
R64  4k7  R-EU_R0402  [R0402]
R65  330R  R-EU_R0402  [R0402]
SJ1  SJ2W_DEFAULT  [SJ_2_DEFAULT]
SJ2  SJ2W_DEFAULT  [SJ_2_DEFAULT]
SJ3  SJ2W_DEFAULT  [SJ_2_DEFAULT]
SJ4  SJ2W_DEFAULT  [SJ_2_DEFAULT]
SJ5  SJ2W_DEFAULT  [SJ_2_DEFAULT]
TP15  TP_06MM  [TP_06]  (not fitted in variant TOP_SMD_FULL)  (not fitted in variant TOP_SMD_WITHOUT_MPU)  (not fitted in variant TOP_SMD_WITHOUT_MOTOR_CURRENT)  (not fitted in variant TOP_SMD_WITHOUT_SERVO_CURRENT)  (not fitted in variant TOP_SMD_WITHOUT_CURRENT)  (not fitted in variant TOP_SMD_MINIMAL)
TP16  TP_06MM  [TP_06]  (not fitted in variant TOP_SMD_FULL)  (not fitted in variant TOP_SMD_WITHOUT_MPU)  (not fitted in variant TOP_SMD_WITHOUT_MOTOR_CURRENT)  (not fitted in variant TOP_SMD_WITHOUT_SERVO_CURRENT)  (not fitted in variant TOP_SMD_WITHOUT_CURRENT)  (not fitted in variant TOP_SMD_MINIMAL)

### Nets
+3V3: JP11.3 JP12.3 JP15.1 JP19.3 JP21.1 JP22.1 JP24.3 JP25.3 JP26.3 JP28.1 JP30.3 Q5.1(G) Q6.1(G) Q7.1(G) R24.2 R37.2 R42.2 R50.1 R51.1 R57.1 R62.1 SJ1.3 SJ2.3 SJ3.1 SJ5.1 ; also sheet 1,3,7
+3V3S: D11.3(C) JP29.5 JP29.6 SJ4.3 ; also sheet 1,3,4,5,6,8
+5V: JP6.1 JP13.1 JP16.1 JP20.1 JP29.7 JP29.8 R63.2 SJ1.1 SJ2.1 SJ3.3 SJ4.1 SJ5.3 ; also sheet 1,3,4,5,6,7
D11_NC: D11.2(A2) NC7.NC
ESP-I2C-PWR: JP7.1 JP10.3 JP14.1 JP17.3 R25.2 R38.2 R43.2 SJ2.2
ESP-I2C-SCL: JP22.3 JP28.3 Q5.2(S) R24.1 R29.2 ; also sheet 8
ESP-I2C-SCL-VSEL: JP7.3 JP14.3 Q5.3(D) R25.1
ESP-I2C-SDA: JP22.4 JP28.4 Q6.2(S) R37.1 R41.2 ; also sheet 8
ESP-I2C-SDA-VSEL: JP7.4 JP14.4 Q6.3(D) R38.1
ESP-SPI-!CS1: JP8.6 R34.2
ESP-SPI-!CS2: JP15.6 R46.2
ESP-SPI-!CS3: JP21.6 R54.2
ESP-SPI-MISO: JP8.4 JP15.4 JP21.4 R30.2
ESP-SPI-MOSI: JP8.3 JP15.3 JP21.3 R28.2
ESP-SPI-SCK: JP8.5 JP15.5 JP21.5 R32.2
ESP-USART-RX: JP9.3 R31.2
ESP-USART-TX: JP9.4 R33.2
ESP_EN: Q8.1(G) ; also sheet 3,4,7,8
ESP_SPI_PWR: JP8.1 SJ1.2
ESP_UCOM_PWR: JP23.1 SJ5.2
ESP_USART_PWR: JP9.1 SJ3.2
GND: IM2.GND JP6.4 JP7.2 JP8.2 JP9.2 JP10.2 JP11.2 JP12.2 JP13.4 JP14.2 JP15.2 JP16.4 JP17.2 JP18.2 JP19.2 JP20.4 JP21.2 JP22.2 JP23.2 JP24.2 JP25.2 JP26.2 JP28.2 JP29.3 JP29.4 JP30.2 JP31.3 ; also sheet 1,3,4,5,6,7,8
GPIO1: R36.1 ; also sheet 7
GPIO2: R58.1 ; also sheet 7
GPIO3: R55.1 ; also sheet 7
GPIO4: R56.1 ; also sheet 7
GPIO5: R35.1 ; also sheet 7
GPIO6/TMS: R59.1 ; also sheet 3,7
GPIO7/TCK: R45.1 ; also sheet 3,7
GPIO-1: JP12.1 R36.2
GPIO-1-VSEL: JP10.1 Q7.3(D) R43.1
GPIO-2: JP25.1 R58.2 ; also sheet 3
GPIO-3: JP23.3 R55.2
GPIO-4: JP23.4 R56.2
GPIO-5: JP11.1 R35.2
GPIO-6: JP26.1 R59.2
GPIO-7: Q7.2(S) R42.1 R45.2
I2C_SCL: R29.1 ; also sheet 7
I2C_SDA: R41.1 ; also sheet 7
I_LED/TDI: R65.1 ; also sheet 3,7
ILED: Q8.2(S) R65.2 TP16.P$1(TP)
ILED-5V: JP31.1 Q8.3(D) R64.1 ; also sheet 3
ILED_EN: D11.1(A1) IM2.EN JP27.1
ILED_PWR: IM2.OUT JP31.2 R63.1 R64.2 TP15.P$1(TP)
IN1: JP19.1 R51.2 ; also sheet 7
IN2: JP24.1 R57.2 ; also sheet 7
IN3: D10.A R50.2 ; also sheet 7
IN3-5V: D10.C JP17.1
IN4: JP30.1 R62.2 ; also sheet 7
SPI_!SS1: R34.1 ; also sheet 7
SPI_!SS2: R46.1 ; also sheet 7
SPI_!SS3!/TDO: R54.1 ; also sheet 3,7
SPI_MISO: R30.1 ; also sheet 7
SPI_MOSI: R28.1 ; also sheet 7
SPI_SCK: R32.1 ; also sheet 7
STM-AIO1: JP29.1 R60.2
STM-AIO2: JP29.2 R61.1
STM-UART-RX: JP18.4 R49.2
STM-UART-TX: JP18.3 R48.2
STM_AIO1: R60.1 ; also sheet 8
STM_AIO2: R61.2 ; also sheet 8
STM_UART_PWR: JP18.1 SJ4.2
UART2_RX: R31.1 ; also sheet 7
UART2_TX: R33.1 ; also sheet 7
USER_RX: R49.1 ; also sheet 8
USER_TX: R48.1 ; also sheet 8
UTS1-ECHO: JP6.3 R27.2
UTS1-TRIG: JP6.2 R26.2
UTS1_ECHO: R27.1 ; also sheet 8
UTS1_TRIG: R26.1 ; also sheet 8
UTS2-ECHO: JP13.3 R40.2
UTS2-TRIG: JP13.2 R39.2
UTS2_ECHO: R40.1 ; also sheet 8
UTS2_TRIG: R39.1 ; also sheet 8
UTS3-ECHO: JP16.3 R47.2
UTS3-TRIG: JP16.2 R44.2
UTS3_ECHO: R47.1 ; also sheet 8
UTS3_TRIG: R44.1 ; also sheet 8
UTS4-ECHO: JP20.3 R53.2
UTS4-TRIG: JP20.2 R52.2
UTS4_ECHO: R53.1 ; also sheet 8
UTS4_TRIG: R52.1 ; also sheet 8
VCC: IM2.IN ; also sheet 1,3,4,5,6

### Notes on the sheet
- SPI | UART
- ULTRASONIC RANGEFINDERS
- I2C
- VSEL
- AUX
- I2C
- 3V3
- ILED
- IO12/TDI on ESP32 has internal pull-down
  during releasing EN, so we need to switch-off
  the transistor to disconnect pull/up R64.
- Released under the Creative Commons Attribution-ShareAlike 4.0 License
  https://creativecommons.org/licenses/by-sa/4.0/
  Designed by: Jaroslav Paral, Jakub Streit
  
  RB3204-RBCX
  https://github.com/RoboticsBrno/RB3204-RBCX
- RB3204-RBCX
- RobotikaBrno
  RobotikaBrno.cz
  Robotarna
  CC BY-SA 4.0
- Jaroslav Paral
  Jakub Streit
  9/2020
- v1.2

## Sheet 3 of 8: Auxiliary connectors
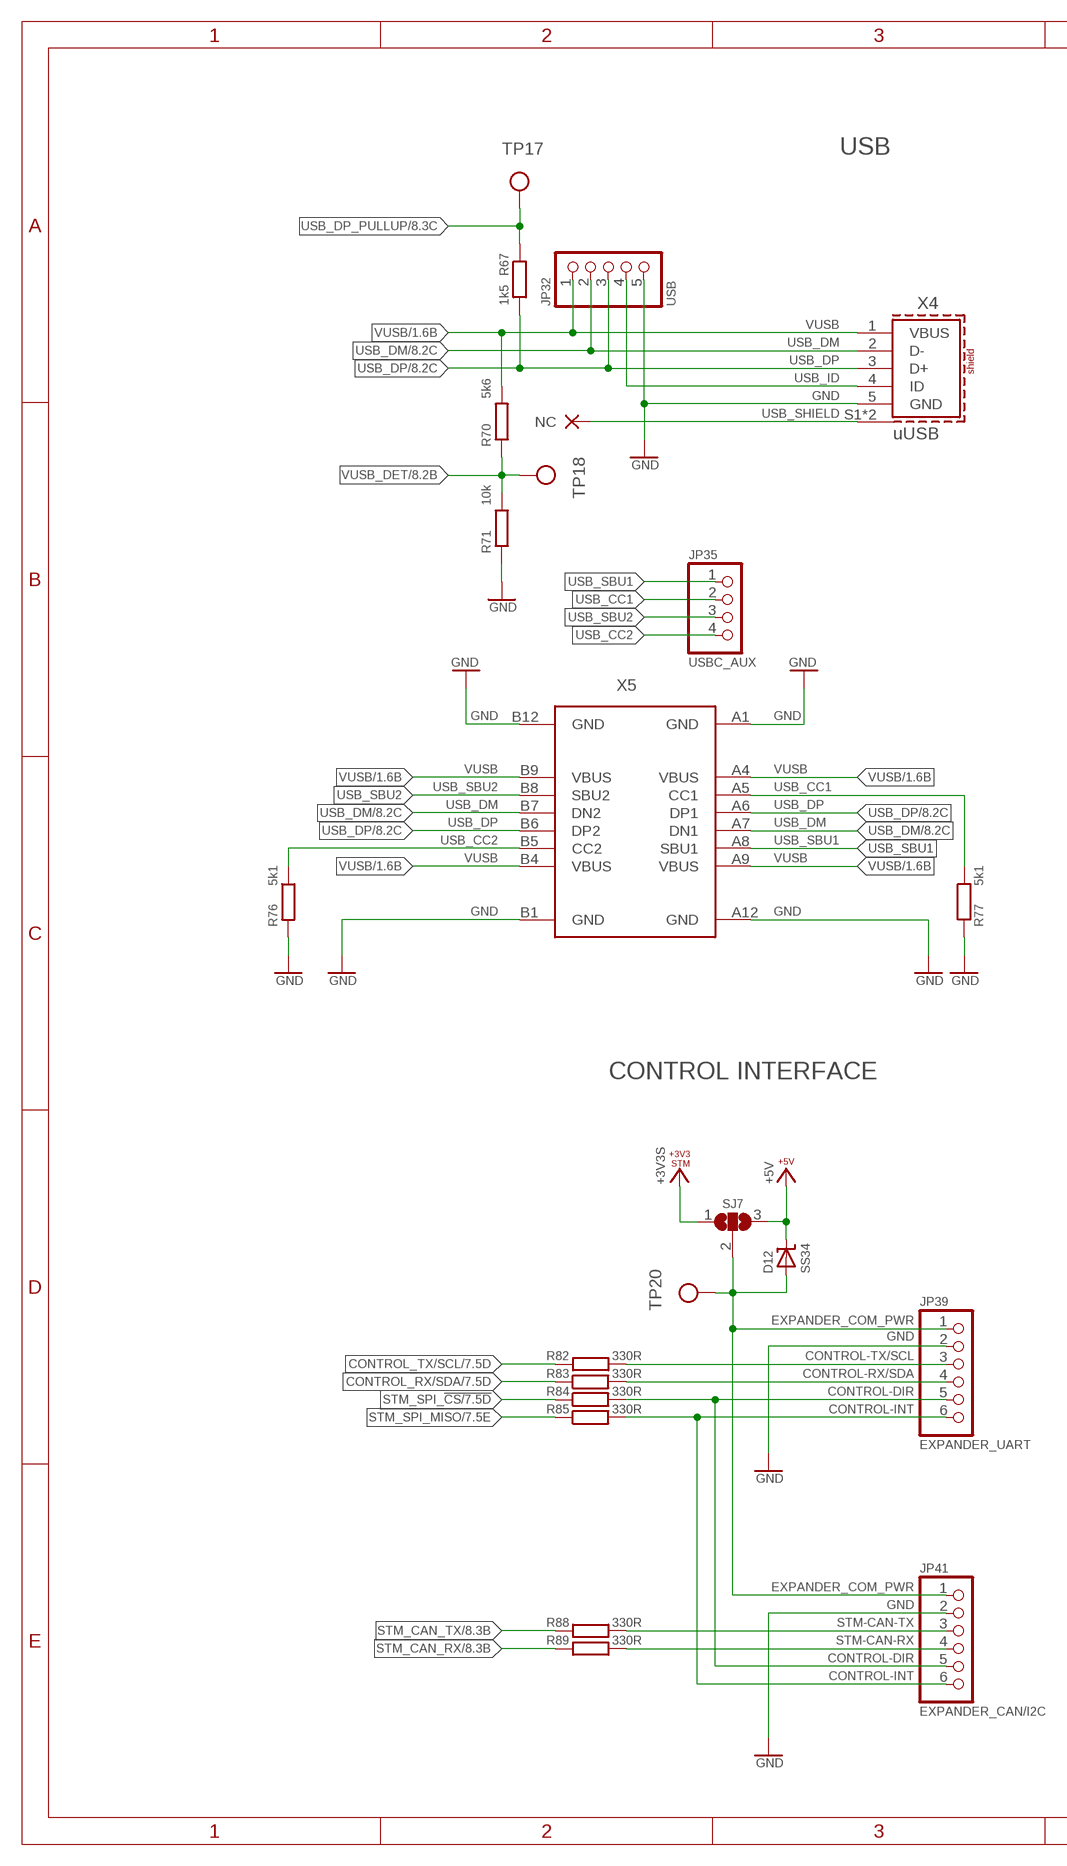
[diagram p4: schematic, sheet 3, part 1 of 2]
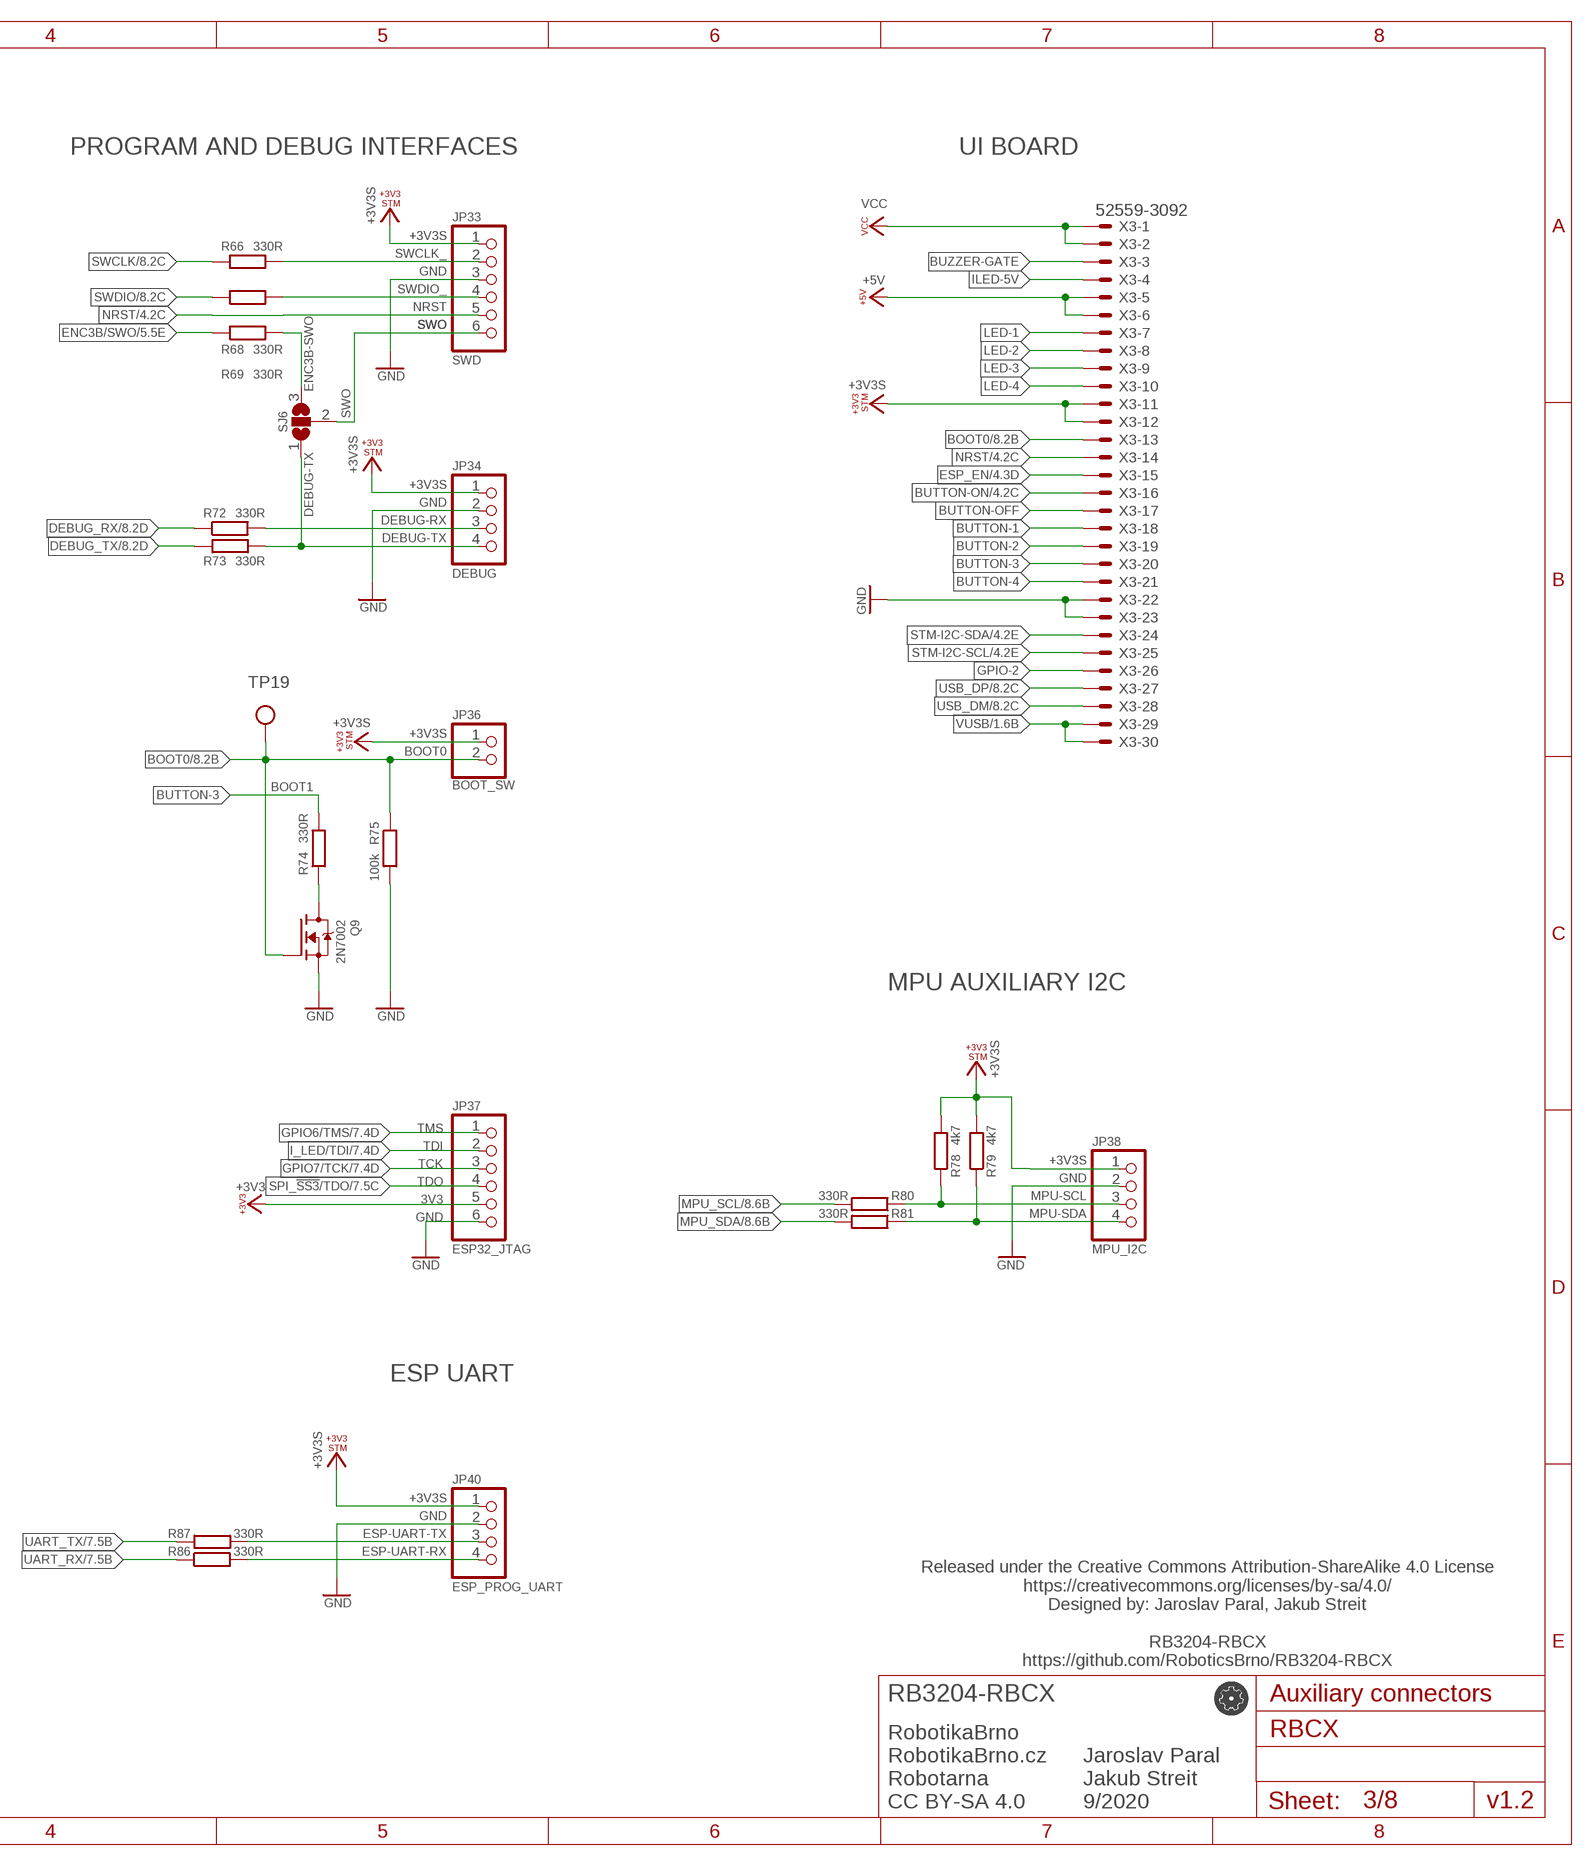
[diagram p5: schematic, sheet 3, part 2 of 2]

### Parts
D12  SS34  SHOTTKY-SMA  [SMA]  (not fitted in variant TOP_SMD_MINIMAL)
JP32  USB  PINHD-1X5  [1X05]  (not fitted in variant TOP_SMD_FULL)  (not fitted in variant TOP_SMD_WITHOUT_MPU)  (not fitted in variant TOP_SMD_WITHOUT_MOTOR_CURRENT)  (not fitted in variant TOP_SMD_WITHOUT_SERVO_CURRENT)  (not fitted in variant TOP_SMD_WITHOUT_CURRENT)  (not fitted in variant TOP_SMD_MINIMAL)
JP33  SWD  PINHD-1X6  [1X06]  (not fitted in variant TOP_SMD_FULL)  (not fitted in variant TOP_SMD_WITHOUT_MPU)  (not fitted in variant TOP_SMD_WITHOUT_MOTOR_CURRENT)  (not fitted in variant TOP_SMD_WITHOUT_SERVO_CURRENT)  (not fitted in variant TOP_SMD_WITHOUT_CURRENT)  (not fitted in variant TOP_SMD_MINIMAL)
JP34  DEBUG  PINHD-1X4  [1X04]  (not fitted in variant TOP_SMD_FULL)  (not fitted in variant TOP_SMD_WITHOUT_MPU)  (not fitted in variant TOP_SMD_WITHOUT_MOTOR_CURRENT)  (not fitted in variant TOP_SMD_WITHOUT_SERVO_CURRENT)  (not fitted in variant TOP_SMD_WITHOUT_CURRENT)  (not fitted in variant TOP_SMD_MINIMAL)
JP35  USBC_AUX  PINHD-1X4  [1X04]  (not fitted in variant TOP_SMD_FULL)  (not fitted in variant TOP_SMD_WITHOUT_MPU)  (not fitted in variant TOP_SMD_WITHOUT_MOTOR_CURRENT)  (not fitted in variant TOP_SMD_WITHOUT_SERVO_CURRENT)  (not fitted in variant TOP_SMD_WITHOUT_CURRENT)  (not fitted in variant TOP_SMD_MINIMAL)
JP36  BOOT_SW  PINHD-1X2  [1X02]  (not fitted in variant TOP_SMD_FULL)  (not fitted in variant TOP_SMD_WITHOUT_MPU)  (not fitted in variant TOP_SMD_WITHOUT_MOTOR_CURRENT)  (not fitted in variant TOP_SMD_WITHOUT_SERVO_CURRENT)  (not fitted in variant TOP_SMD_WITHOUT_CURRENT)  (not fitted in variant TOP_SMD_MINIMAL)
JP37  ESP32_JTAG  PINHD-1X6  [1X06]  (not fitted in variant TOP_SMD_FULL)  (not fitted in variant TOP_SMD_WITHOUT_MPU)  (not fitted in variant TOP_SMD_WITHOUT_MOTOR_CURRENT)  (not fitted in variant TOP_SMD_WITHOUT_SERVO_CURRENT)  (not fitted in variant TOP_SMD_WITHOUT_CURRENT)  (not fitted in variant TOP_SMD_MINIMAL)
JP38  MPU_I2C  PINHD-1X4  [1X04]  (not fitted in variant TOP_SMD_FULL)  (not fitted in variant TOP_SMD_WITHOUT_MPU)  (not fitted in variant TOP_SMD_WITHOUT_MOTOR_CURRENT)  (not fitted in variant TOP_SMD_WITHOUT_SERVO_CURRENT)  (not fitted in variant TOP_SMD_WITHOUT_CURRENT)  (not fitted in variant TOP_SMD_MINIMAL)
JP39  EXPANDER_UART  PINHD-1X6  [1X06]  (not fitted in variant TOP_SMD_FULL)  (not fitted in variant TOP_SMD_WITHOUT_MPU)  (not fitted in variant TOP_SMD_WITHOUT_MOTOR_CURRENT)  (not fitted in variant TOP_SMD_WITHOUT_SERVO_CURRENT)  (not fitted in variant TOP_SMD_WITHOUT_CURRENT)  (not fitted in variant TOP_SMD_MINIMAL)
JP40  ESP_PROG_UART  PINHD-1X4  [1X04]  (not fitted in variant TOP_SMD_FULL)  (not fitted in variant TOP_SMD_WITHOUT_MPU)  (not fitted in variant TOP_SMD_WITHOUT_MOTOR_CURRENT)  (not fitted in variant TOP_SMD_WITHOUT_SERVO_CURRENT)  (not fitted in variant TOP_SMD_WITHOUT_CURRENT)  (not fitted in variant TOP_SMD_MINIMAL)
JP41  EXPANDER_CAN/I2C  PINHD-1X6  [1X06]  (not fitted in variant TOP_SMD_FULL)  (not fitted in variant TOP_SMD_WITHOUT_MPU)  (not fitted in variant TOP_SMD_WITHOUT_MOTOR_CURRENT)  (not fitted in variant TOP_SMD_WITHOUT_SERVO_CURRENT)  (not fitted in variant TOP_SMD_WITHOUT_CURRENT)  (not fitted in variant TOP_SMD_MINIMAL)
NC8  NC  (no package)
Q9  2N7002  N-MOSFET-SOT23-GSD  [SOT23]
R66  330R  R-EU_R0402  [R0402]
R67  1k5  R-EU_R0402  [R0402]
R68  330R  R-EU_R0402  [R0402]
R69  330R  R-EU_R0402  [R0402]
R70  5k6  R-EU_R0402  [R0402]
R71  10k  R-EU_R0402  [R0402]
R72  330R  R-EU_R0402  [R0402]
R73  330R  R-EU_R0402  [R0402]
R74  330R  R-EU_R0402  [R0402]
R75  100k  R-EU_R0402  [R0402]
R76  5k1  R-EU_R0402  [R0402]
R77  5k1  R-EU_R0402  [R0402]
R78  4k7  R-EU_R0402  [R0402]  (not fitted in variant TOP_SMD_FULL)  (not fitted in variant TOP_SMD_WITHOUT_MPU)  (not fitted in variant TOP_SMD_WITHOUT_MOTOR_CURRENT)  (not fitted in variant TOP_SMD_WITHOUT_SERVO_CURRENT)  (not fitted in variant TOP_SMD_WITHOUT_CURRENT)  (not fitted in variant TOP_SMD_MINIMAL)
R79  4k7  R-EU_R0402  [R0402]  (not fitted in variant TOP_SMD_FULL)  (not fitted in variant TOP_SMD_WITHOUT_MPU)  (not fitted in variant TOP_SMD_WITHOUT_MOTOR_CURRENT)  (not fitted in variant TOP_SMD_WITHOUT_SERVO_CURRENT)  (not fitted in variant TOP_SMD_WITHOUT_CURRENT)  (not fitted in variant TOP_SMD_MINIMAL)
R80  330R  R-EU_R0402  [R0402]  (not fitted in variant TOP_SMD_FULL)  (not fitted in variant TOP_SMD_WITHOUT_MPU)  (not fitted in variant TOP_SMD_WITHOUT_MOTOR_CURRENT)  (not fitted in variant TOP_SMD_WITHOUT_SERVO_CURRENT)  (not fitted in variant TOP_SMD_WITHOUT_CURRENT)  (not fitted in variant TOP_SMD_MINIMAL)
R81  330R  R-EU_R0402  [R0402]  (not fitted in variant TOP_SMD_FULL)  (not fitted in variant TOP_SMD_WITHOUT_MPU)  (not fitted in variant TOP_SMD_WITHOUT_MOTOR_CURRENT)  (not fitted in variant TOP_SMD_WITHOUT_SERVO_CURRENT)  (not fitted in variant TOP_SMD_WITHOUT_CURRENT)  (not fitted in variant TOP_SMD_MINIMAL)
R82  330R  R-EU_R0402  [R0402]  (not fitted in variant TOP_SMD_MINIMAL)
R83  330R  R-EU_R0402  [R0402]  (not fitted in variant TOP_SMD_MINIMAL)
R84  330R  R-EU_R0402  [R0402]  (not fitted in variant TOP_SMD_MINIMAL)
R85  330R  R-EU_R0402  [R0402]  (not fitted in variant TOP_SMD_MINIMAL)
R86  330R  R-EU_R0402  [R0402]  (not fitted in variant TOP_SMD_MINIMAL)
R87  330R  R-EU_R0402  [R0402]  (not fitted in variant TOP_SMD_MINIMAL)
R88  330R  R-EU_R0402  [R0402]  (not fitted in variant TOP_SMD_MINIMAL)
R89  330R  R-EU_R0402  [R0402]  (not fitted in variant TOP_SMD_MINIMAL)
SJ6  SJ2W0603  [SJ_2_0603]  (not fitted in variant TOP_SMD_FULL)  (not fitted in variant TOP_SMD_WITHOUT_MPU)  (not fitted in variant TOP_SMD_WITHOUT_MOTOR_CURRENT)  (not fitted in variant TOP_SMD_WITHOUT_SERVO_CURRENT)  (not fitted in variant TOP_SMD_WITHOUT_CURRENT)  (not fitted in variant TOP_SMD_MINIMAL)
SJ7  SJ2W0603  [SJ_2_0603]  (not fitted in variant TOP_SMD_FULL)  (not fitted in variant TOP_SMD_WITHOUT_MPU)  (not fitted in variant TOP_SMD_WITHOUT_MOTOR_CURRENT)  (not fitted in variant TOP_SMD_WITHOUT_SERVO_CURRENT)  (not fitted in variant TOP_SMD_WITHOUT_CURRENT)  (not fitted in variant TOP_SMD_MINIMAL)
TP17  TP_06MM  [TP_06]  (not fitted in variant TOP_SMD_FULL)  (not fitted in variant TOP_SMD_WITHOUT_MPU)  (not fitted in variant TOP_SMD_WITHOUT_MOTOR_CURRENT)  (not fitted in variant TOP_SMD_WITHOUT_SERVO_CURRENT)  (not fitted in variant TOP_SMD_WITHOUT_CURRENT)  (not fitted in variant TOP_SMD_MINIMAL)
TP18  TP_06MM  [TP_06]  (not fitted in variant TOP_SMD_FULL)  (not fitted in variant TOP_SMD_WITHOUT_MPU)  (not fitted in variant TOP_SMD_WITHOUT_MOTOR_CURRENT)  (not fitted in variant TOP_SMD_WITHOUT_SERVO_CURRENT)  (not fitted in variant TOP_SMD_WITHOUT_CURRENT)  (not fitted in variant TOP_SMD_MINIMAL)
TP19  TP_06MM  [TP_06]  (not fitted in variant TOP_SMD_FULL)  (not fitted in variant TOP_SMD_WITHOUT_MPU)  (not fitted in variant TOP_SMD_WITHOUT_MOTOR_CURRENT)  (not fitted in variant TOP_SMD_WITHOUT_SERVO_CURRENT)  (not fitted in variant TOP_SMD_WITHOUT_CURRENT)  (not fitted in variant TOP_SMD_MINIMAL)
TP20  TP_06MM  [TP_06]  (not fitted in variant TOP_SMD_FULL)  (not fitted in variant TOP_SMD_WITHOUT_MPU)  (not fitted in variant TOP_SMD_WITHOUT_MOTOR_CURRENT)  (not fitted in variant TOP_SMD_WITHOUT_SERVO_CURRENT)  (not fitted in variant TOP_SMD_WITHOUT_CURRENT)  (not fitted in variant TOP_SMD_MINIMAL)
X3  52559-3092  [52559-3092]  (not fitted in variant TOP_SMD_FULL)  (not fitted in variant TOP_SMD_WITHOUT_MPU)  (not fitted in variant TOP_SMD_WITHOUT_MOTOR_CURRENT)  (not fitted in variant TOP_SMD_WITHOUT_SERVO_CURRENT)  (not fitted in variant TOP_SMD_WITHOUT_CURRENT)  (not fitted in variant TOP_SMD_MINIMAL)
X4  uUSB  614105150621  [614105150621]  (not fitted in variant TOP_SMD_FULL)  (not fitted in variant TOP_SMD_WITHOUT_MPU)  (not fitted in variant TOP_SMD_WITHOUT_MOTOR_CURRENT)  (not fitted in variant TOP_SMD_WITHOUT_SERVO_CURRENT)  (not fitted in variant TOP_SMD_WITHOUT_CURRENT)  (not fitted in variant TOP_SMD_MINIMAL)
X5  USB_C_8PIN  [USB_C_VERT_THT_8PIN]  (not fitted in variant TOP_SMD_FULL)  (not fitted in variant TOP_SMD_WITHOUT_MPU)  (not fitted in variant TOP_SMD_WITHOUT_MOTOR_CURRENT)  (not fitted in variant TOP_SMD_WITHOUT_SERVO_CURRENT)  (not fitted in variant TOP_SMD_WITHOUT_CURRENT)  (not fitted in variant TOP_SMD_MINIMAL)

### Nets
+3V3: JP37.5 ; also sheet 1,2,7
+3V3S: JP33.1 JP34.1 JP36.1 JP38.1 JP40.1 R78.2 R79.2 SJ7.1 X3.11 X3.12 ; also sheet 1,2,4,5,6,8
+5V: D12.C SJ7.3 X3.5 X3.6 ; also sheet 1,2,4,5,6,7
BOOT0: JP36.2 Q9.1(G) R75.1 TP19.P$1(TP) X3.13 ; also sheet 8
BOOT1_PULL-DOWN: Q9.3(D) R74.1
BUTTON-1: X3.18 ; also sheet 4
BUTTON-2: X3.19 ; also sheet 4
BUTTON-3: R74.2 X3.20 ; also sheet 4
BUTTON-4: X3.21 ; also sheet 4
BUTTON-OFF: X3.17 ; also sheet 4
BUTTON-ON: X3.16 ; also sheet 1,4
BUZZER-GATE: X3.3 ; also sheet 4
CONTROL-DIR: JP39.5 JP41.5 R84.2
CONTROL-INT: JP39.6 JP41.6 R85.2
CONTROL-RX/SDA: JP39.4 R83.2
CONTROL-TX/SCL: JP39.3 R82.2
CONTROL_RX/SDA: R83.1 ; also sheet 7,8
CONTROL_TX/SCL: R82.1 ; also sheet 7,8
DEBUG-RX: JP34.3 R72.2
DEBUG-TX: JP34.4 R73.2 SJ6.1
DEBUG_RX: R72.1 ; also sheet 8
DEBUG_TX: R73.1 ; also sheet 8
ENC3B-SWO: R69.2 SJ6.3
ENC3B/SWO: R69.1 ; also sheet 5,8
ESP-UART-RX: JP40.4 R87.2
ESP-UART-TX: JP40.3 R86.2
ESP_EN: X3.15 ; also sheet 2,4,7,8
EXPANDER_COM_PWR: D12.A JP39.1 JP41.1 SJ7.2 TP20.P$1(TP)
GND: JP32.5 JP33.3 JP34.2 JP37.6 JP38.2 JP39.2 JP40.2 JP41.2 Q9.2(S) R71.1 R75.2 R76.2 R77.2 X3.22 X3.23 X4.5(GND) X5.A1(GND) X5.A12(GND) X5.B1(GND) X5.B12(GND) ; also sheet 1,2,4,5,6,7,8
GPIO6/TMS: JP37.1 ; also sheet 2,7
GPIO7/TCK: JP37.3 ; also sheet 2,7
GPIO-2: X3.26 ; also sheet 2
I_LED/TDI: JP37.2 ; also sheet 2,7
ILED-5V: X3.4 ; also sheet 2
LED-1: X3.7 ; also sheet 4
LED-2: X3.8 ; also sheet 4
LED-3: X3.9 ; also sheet 4
LED-4: X3.10 ; also sheet 4
MPU-SCL: JP38.3 R78.1 R80.1
MPU-SDA: JP38.4 R79.1 R81.1
MPU_SCL: R80.2 ; also sheet 8
MPU_SDA: R81.2 ; also sheet 8
NRST: JP33.5 X3.14 ; also sheet 4,8
SPI_!SS3!/TDO: JP37.4 ; also sheet 2,7
STM-CAN-RX: JP41.4 R89.2
STM-CAN-TX: JP41.3 R88.2
STM-I2C-SCL: X3.25 ; also sheet 4,8
STM-I2C-SDA: X3.24 ; also sheet 4,8
STM_CAN_RX: R89.1 ; also sheet 8
STM_CAN_TX: R88.1 ; also sheet 8
STM_SPI_!CS: R84.1 ; also sheet 7,8
STM_SPI_MISO: R85.1 ; also sheet 7,8
SWCLK: R66.1 ; also sheet 8
SWCLK_: JP33.2 R66.2
SWDIO: R68.1 ; also sheet 8
SWDIO_: JP33.4 R68.2
SWO: JP33.6 SJ6.2
UART_RX: R87.1 ; also sheet 7
UART_TX: R86.1 ; also sheet 7
USB_CC1: JP35.2 R77.1 X5.A5(CC1)
USB_CC2: JP35.4 R76.1 X5.B5(CC2)
USB_DM: JP32.2 X3.28 X4.2(D-) X5.A7(DN1) X5.B7(DN2) ; also sheet 8
USB_DP: JP32.3 R67.2 X3.27 X4.3(D+) X5.A6(DP1) X5.B6(DP2) ; also sheet 8
USB_DP_PULLUP: R67.1 TP17.P$1(TP) ; also sheet 8
USB_ID: JP32.4 X4.4(ID)
USB_SBU1: JP35.1 X5.A8(SBU1)
USB_SBU2: JP35.3 X5.B8(SBU2)
USB_SHIELD: NC8.NC X4.S1(SHIELD) X4.S2(SHIELD)
VCC: X3.1 X3.2 ; also sheet 1,2,4,5,6
VUSB: JP32.1 R70.2 X3.29 X3.30 X4.1(VBUS) X5.A4(VBUS) X5.A9(VBUS) X5.B4(VBUS) X5.B9(VBUS) ; also sheet 1
VUSB_DET: R70.1 R71.2 TP18.P$1(TP) ; also sheet 8

### Notes on the sheet
- USB | PROGRAM AND DEBUG INTERFACES | UI BOARD
- BOOT1
- MPU AUXILIARY I2C
- CONTROL INTERFACE
- TMS
- TDI
- TCK
- TDO
- 3V3
- GND
- ESP UART
- Released under the Creative Commons Attribution-ShareAlike 4.0 License
  https://creativecommons.org/licenses/by-sa/4.0/
  Designed by: Jaroslav Paral, Jakub Streit
  
  RB3204-RBCX
  https://github.com/RoboticsBrno/RB3204-RBCX
- RB3204-RBCX
- RobotikaBrno
  RobotikaBrno.cz
  Robotarna
  CC BY-SA 4.0
- Jaroslav Paral
  Jakub Streit
  9/2020
- v1.2